# EAGLE schematic PDNode-600 Pro (EAGLE 9.2.1)

## Sheet 1 of 11
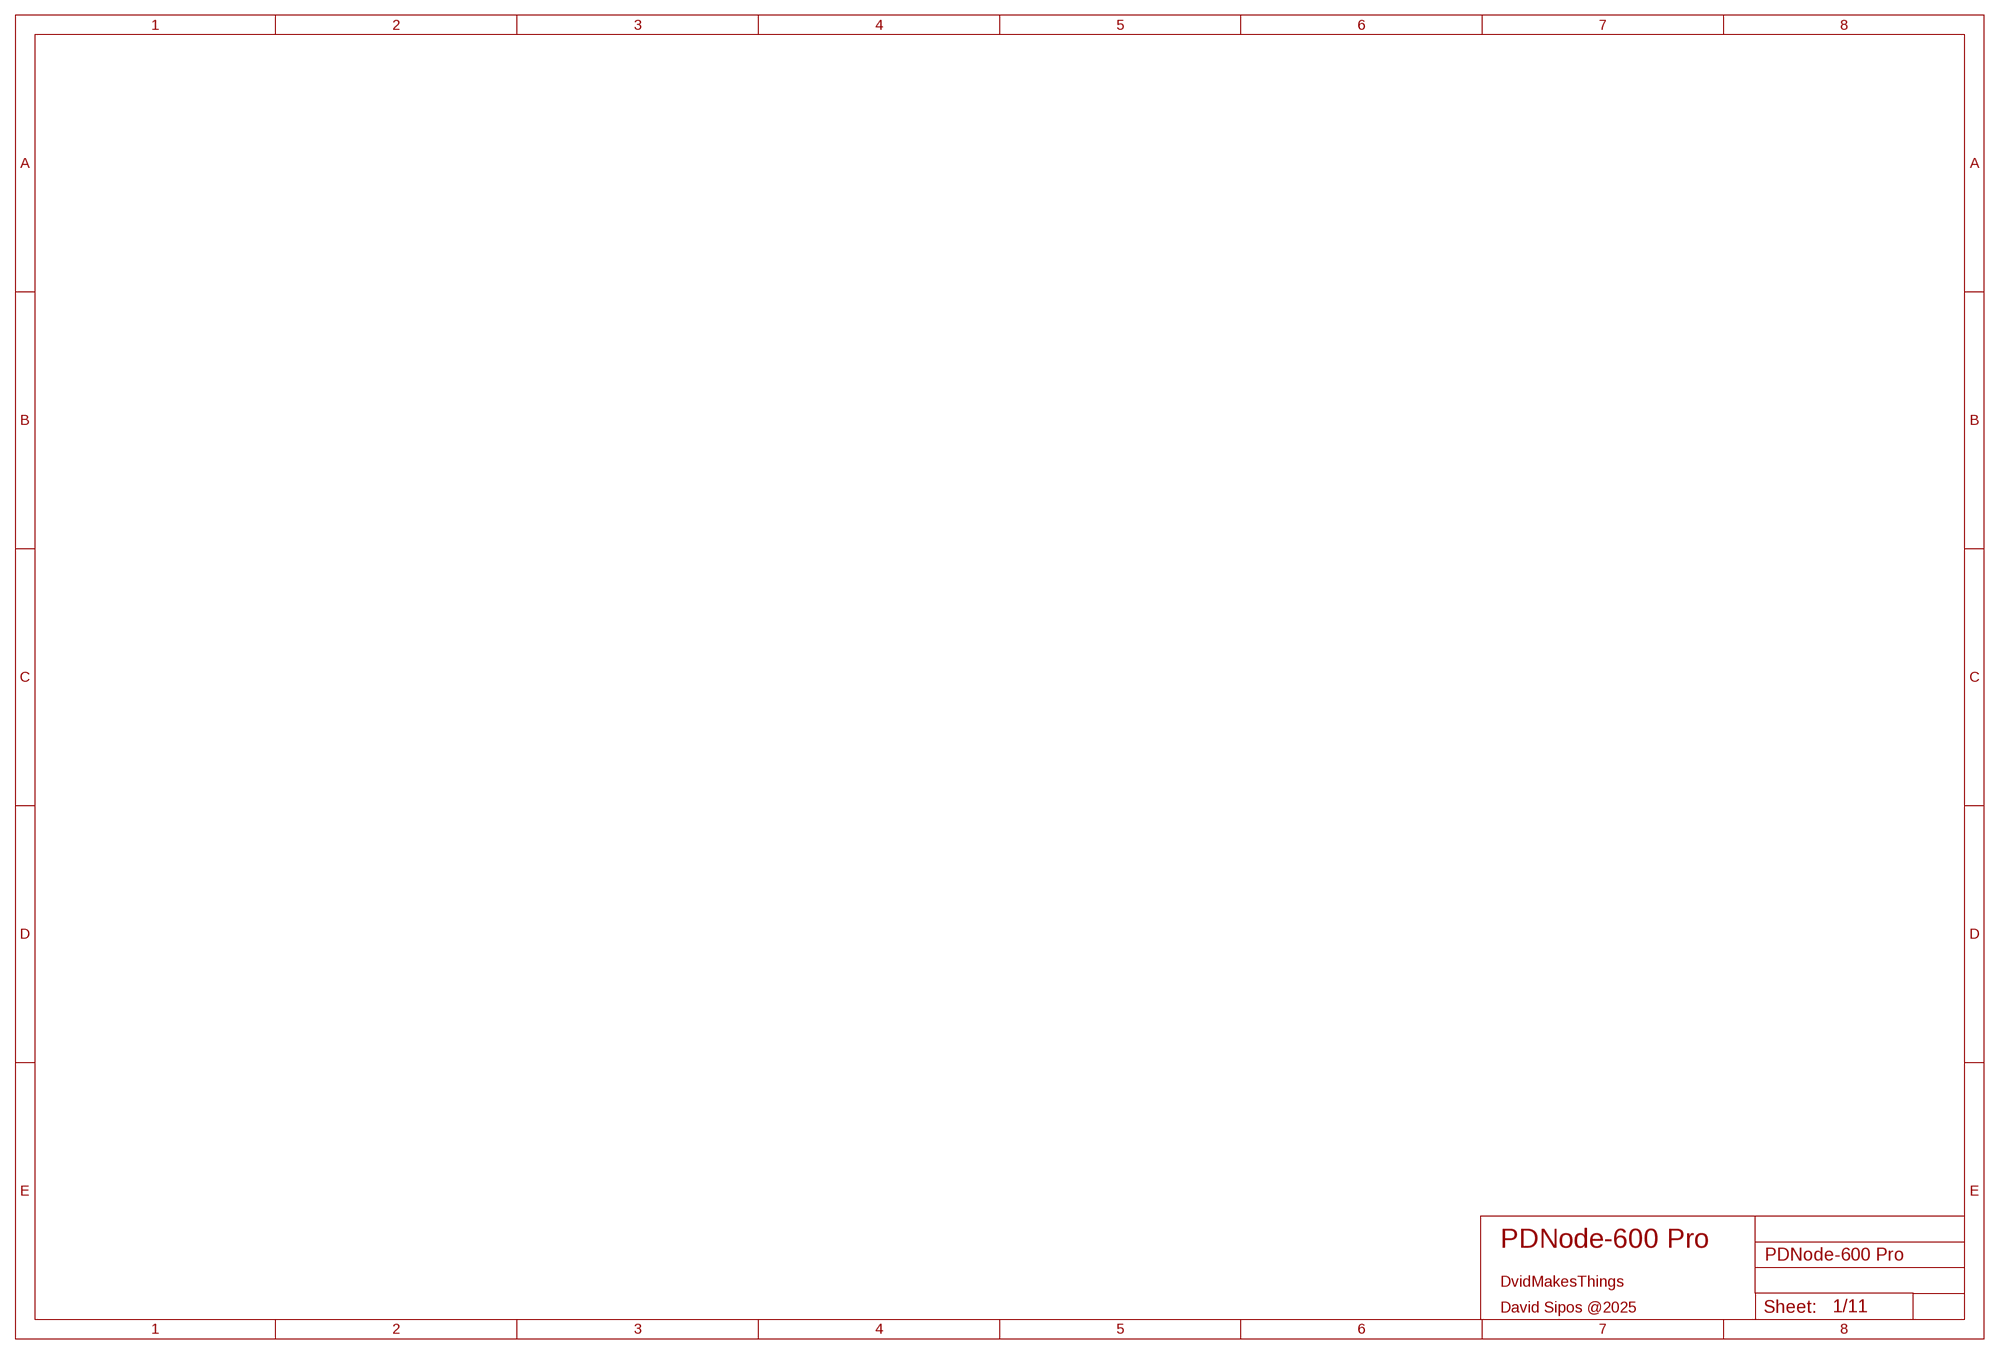
[diagram p0: schematic, sheet 1]

### Notes on the sheet
- PDNode-600 Pro
- DvidMakesThings
- David Sipos @2025

## Sheet 2 of 11
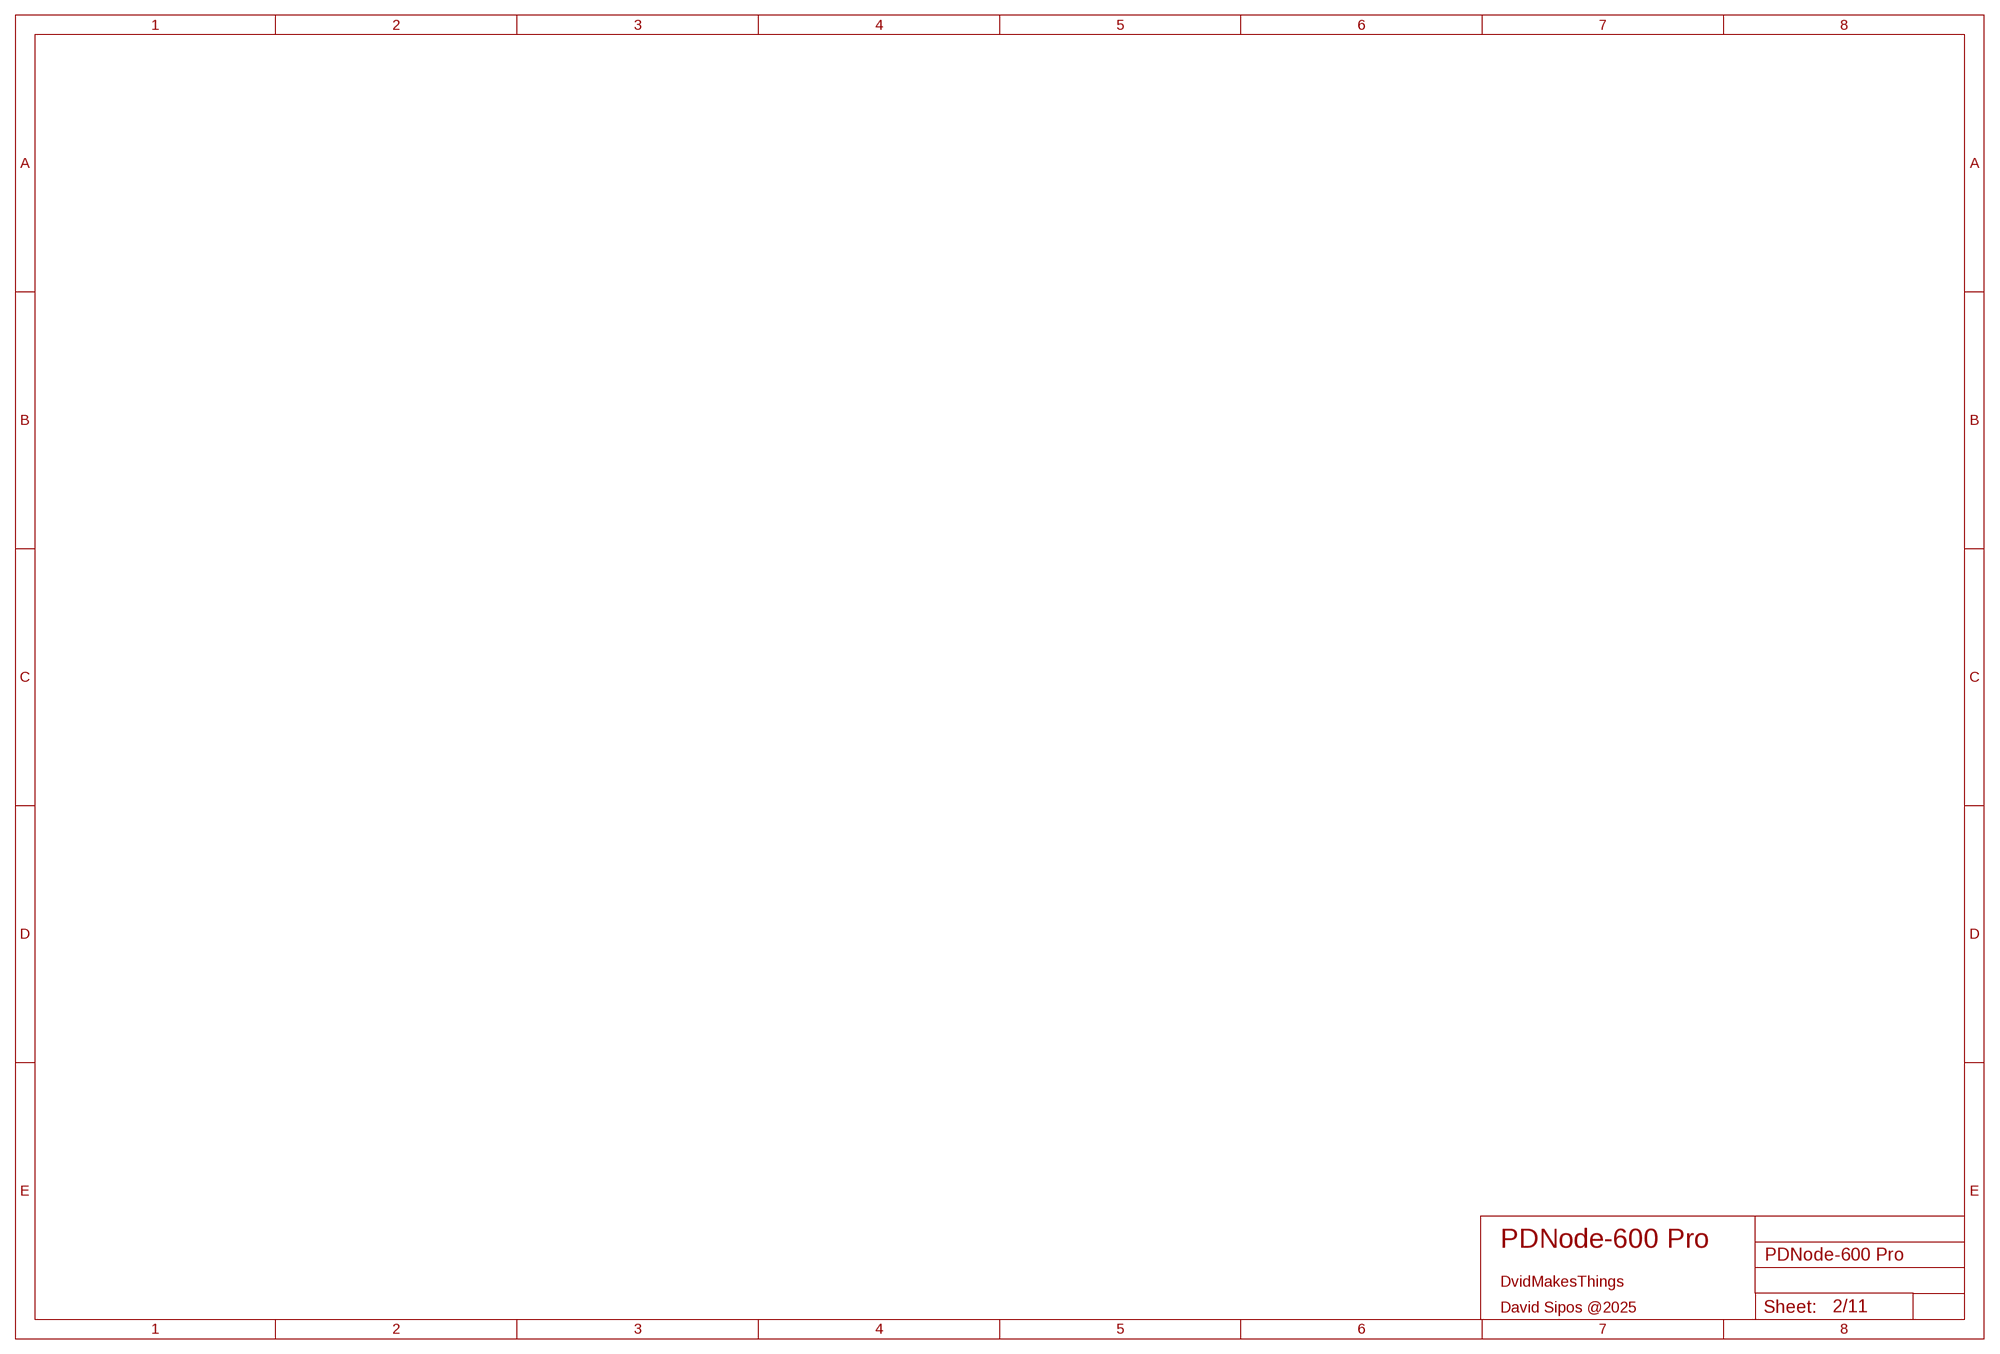
[diagram p1: schematic, sheet 2]

### Notes on the sheet
- PDNode-600 Pro
- DvidMakesThings
- David Sipos @2025

## Sheet 3 of 11: USB-A SOURCE PORT1-4
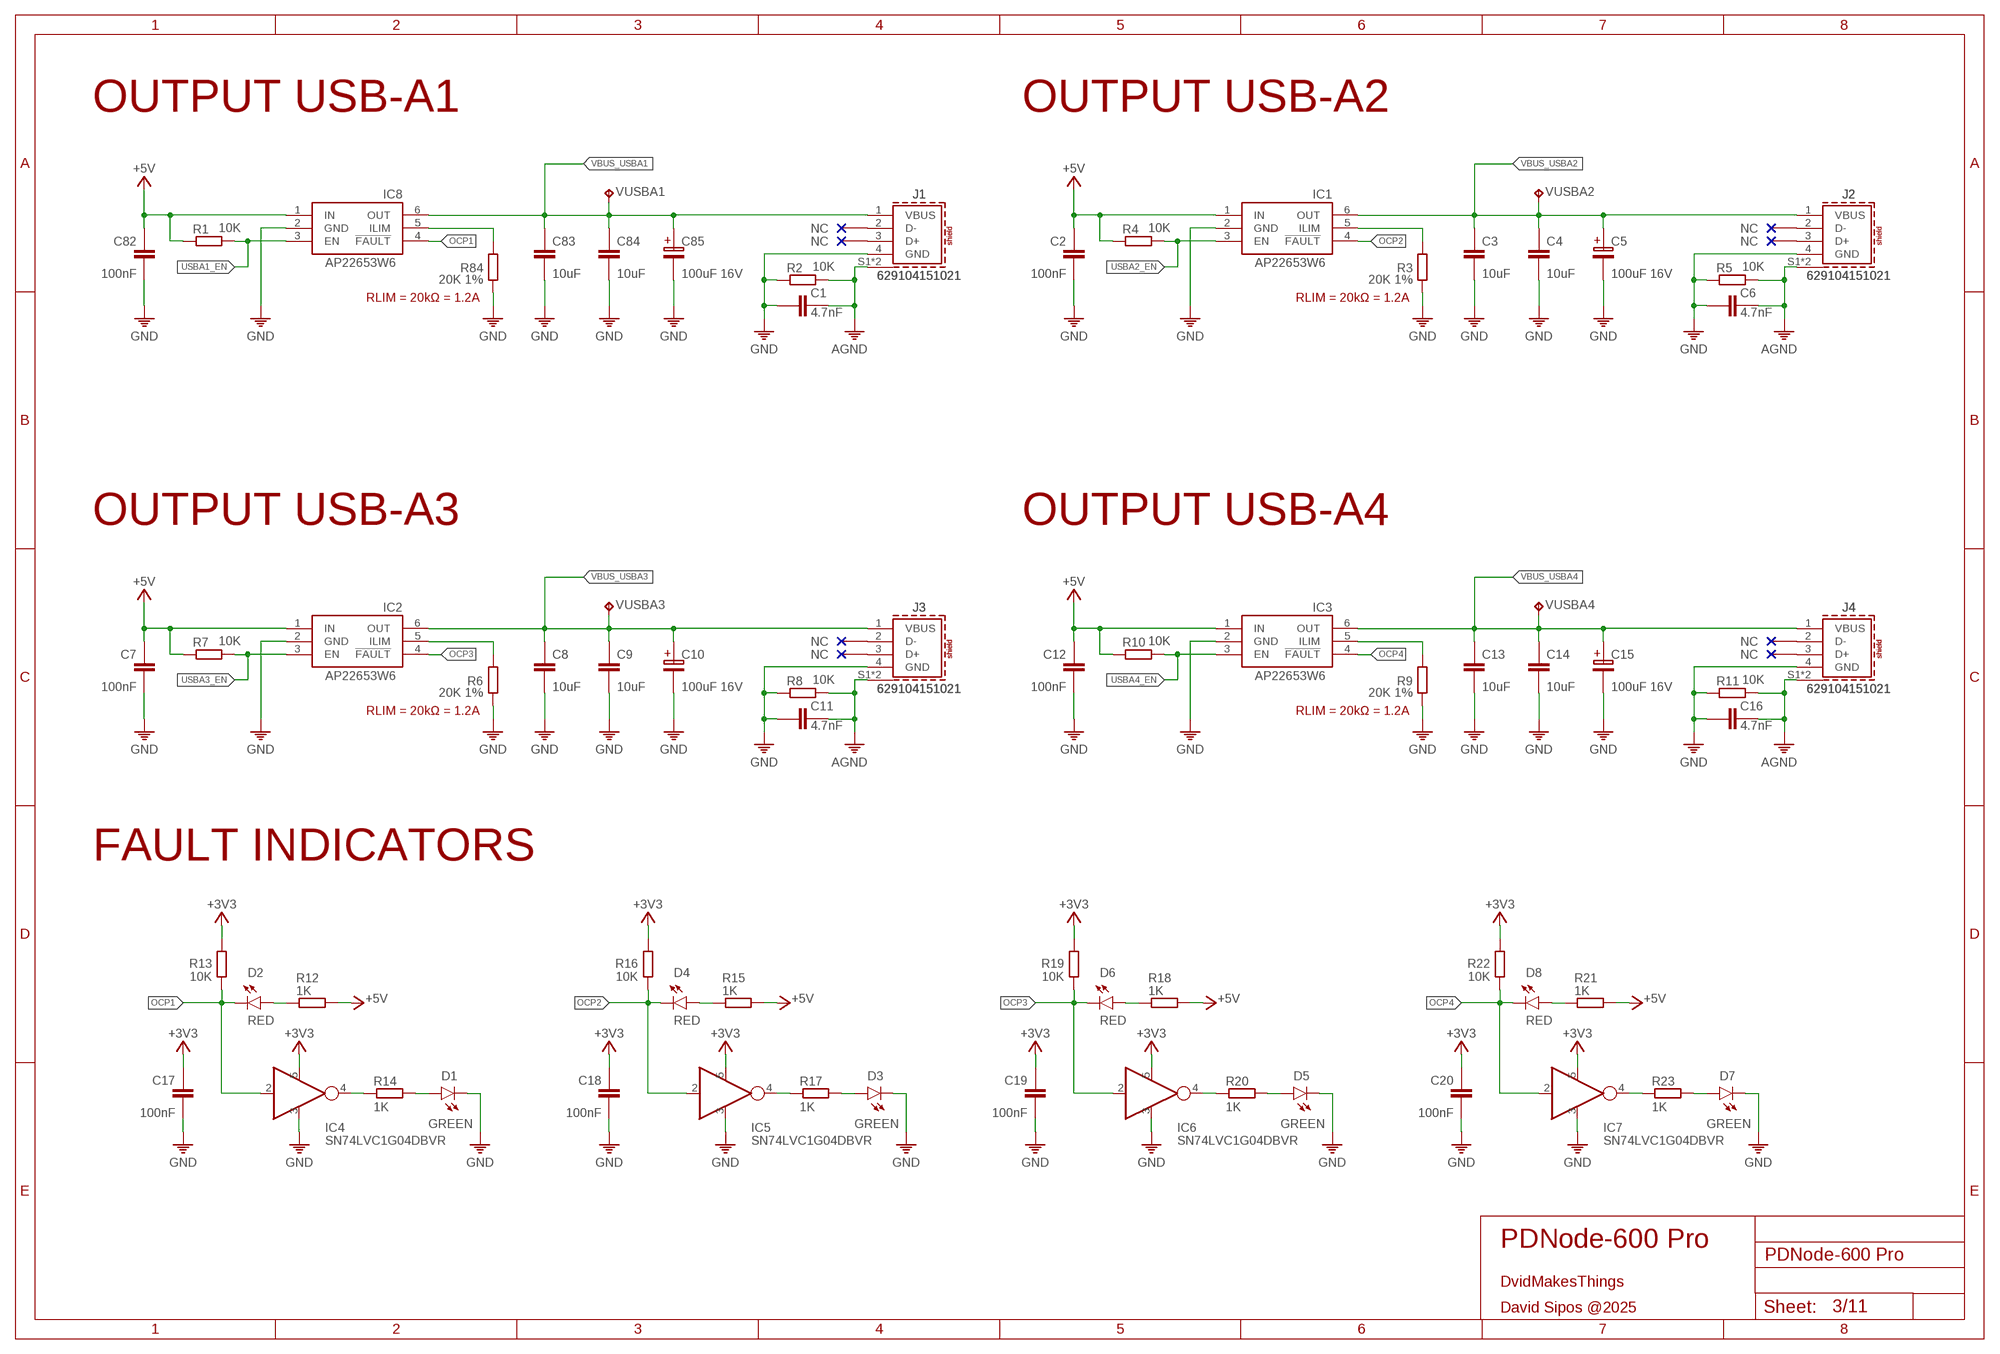
[diagram p2: schematic, sheet 3]

### Parts
C1  4.7nF  C-0402  [C0402]
C2  100nF  C-0402  [C0402]
C3  10uF  C-0805  [C0805]
C4  10uF  C-0805  [C0805]
C5  100uF 16V  CPOL  [100UF-16V]
C6  4.7nF  C-0402  [C0402]
C7  100nF  C-0402  [C0402]
C8  10uF  C-0805  [C0805]
C9  10uF  C-0805  [C0805]
C10  100uF 16V  CPOL  [100UF-16V]
C11  4.7nF  C-0402  [C0402]
C12  100nF  C-0402  [C0402]
C13  10uF  C-0805  [C0805]
C14  10uF  C-0805  [C0805]
C15  100uF 16V  CPOL  [100UF-16V]
C16  4.7nF  C-0402  [C0402]
C17  100nF  C-0402  [C0402]
C18  100nF  C-0402  [C0402]
C19  100nF  C-0402  [C0402]
C20  100nF  C-0402  [C0402]
C82  100nF  C-0402  [C0402]
C83  10uF  C-0805  [C0805]
C84  10uF  C-0805  [C0805]
C85  100uF 16V  CPOL  [100UF-16V]
D1  GREEN  CHIP-FLAT-G_0603-0.35MM  [LEDC1608X35N_FLAT-G]
D2  RED  CHIP-FLAT-R_0603-0.35MM  [LEDC1608X35N_FLAT-R]
D3  GREEN  CHIP-FLAT-G_0603-0.35MM  [LEDC1608X35N_FLAT-G]
D4  RED  CHIP-FLAT-R_0603-0.35MM  [LEDC1608X35N_FLAT-R]
D5  GREEN  CHIP-FLAT-G_0603-0.35MM  [LEDC1608X35N_FLAT-G]
D6  RED  CHIP-FLAT-R_0603-0.35MM  [LEDC1608X35N_FLAT-R]
D7  GREEN  CHIP-FLAT-G_0603-0.35MM  [LEDC1608X35N_FLAT-G]
D8  RED  CHIP-FLAT-R_0603-0.35MM  [LEDC1608X35N_FLAT-R]
IC1  AP22653W6  [SOT23-6]
IC2  AP22653W6  [SOT23-6]
IC3  AP22653W6  [SOT23-6]
IC4  SN74LVC1G04DBVR  74LVC1G04  [SOT95P280X145-5N]
IC5  SN74LVC1G04DBVR  74LVC1G04  [SOT95P280X145-5N]
IC6  SN74LVC1G04DBVR  74LVC1G04  [SOT95P280X145-5N]
IC7  SN74LVC1G04DBVR  74LVC1G04  [SOT95P280X145-5N]
IC8  AP22653W6  [SOT23-6]
J1  629104151021  [629104151021]
J2  629104151021  [629104151021]
J3  629104151021  [629104151021]
J4  629104151021  [629104151021]
R1  10K  R0402  [0402]
R2  10K  R0402  [0402]
R3  20K 1%  R0402  [0402]
R4  10K  R0402  [0402]
R5  10K  R0402  [0402]
R6  20K 1%  R0402  [0402]
R7  10K  R0402  [0402]
R8  10K  R0402  [0402]
R9  20K 1%  R0402  [0402]
R10  10K  R0402  [0402]
R11  10K  R0402  [0402]
R12  1K  R0402  [0402]
R13  10K  R0402  [0402]
R14  1K  R0402  [0402]
R15  1K  R0402  [0402]
R16  10K  R0402  [0402]
R17  1K  R0402  [0402]
R18  1K  R0402  [0402]
R19  10K  R0402  [0402]
R20  1K  R0402  [0402]
R21  1K  R0402  [0402]
R22  10K  R0402  [0402]
R23  1K  R0402  [0402]
R84  20K 1%  R0402  [0402]
VUSBA1  TPB1,27  [B1,27]
VUSBA2  TPB1,27  [B1,27]
VUSBA3  TPB1,27  [B1,27]
VUSBA4  TPB1,27  [B1,27]

### Nets
+3V3: C17.1 C18.1 C19.1 C20.1 IC4.5(V+) IC5.5(V+) IC6.5(V+) IC7.5(V+) R13.2 R16.2 R19.2 R22.2 ; also sheet 4,5,6,7,8,9,10,11
+5V: C2.1 C7.1 C12.1 C82.1 IC1.1(IN) IC2.1(IN) IC3.1(IN) IC8.1(IN) R1.1 R4.1 R7.1 R10.1 R12.2 R15.2 R18.2 R21.2
AGND: C1.2 C6.2 C11.2 C16.2 J1.S1(SHIELD) J1.S2(SHIELD) J2.S1(SHIELD) J2.S2(SHIELD) J3.S1(SHIELD) J3.S2(SHIELD) J4.S1(SHIELD) J4.S2(SHIELD) R2.2 R5.2 R8.2 R11.2 ; also sheet 4,5,6,7,8,9,10,11
GND: C1.1 C2.2 C3.2 C4.2 C5.2 C6.1 C7.2 C8.2 C9.2 C10.2 C11.1 C12.2 C13.2 C14.2 C15.2 C16.1 C17.2 C18.2 C19.2 C20.2 C82.2 C83.2 C84.2 C85.2 D1.C D3.C D5.C D7.C IC1.2(GND) IC2.2(GND) IC3.2(GND) IC4.3(V-) IC5.3(V-) IC6.3(V-) IC7.3(V-) IC8.2(GND) J1.4(GND) J2.4(GND) J3.4(GND) J4.4(GND) R2.1 R3.2 R5.1 R6.2 R8.1 R9.2 R11.1 R84.2 ; also sheet 4,5,6,7,8,9,10,11
N$1: IC1.5(ILIM) R3.1
N$2: IC2.5(ILIM) R6.1
N$3: IC3.5(ILIM) R9.1
N$4: D2.A R12.1
N$5: IC4.4(OUT) R14.1
N$6: D1.A R14.2
N$7: D4.A R15.1
N$8: IC5.4(OUT) R17.1
N$9: D3.A R17.2
N$10: D6.A R18.1
N$11: IC6.4(OUT) R20.1
N$12: D5.A R20.2
N$13: D8.A R21.1
N$14: IC7.4(OUT) R23.1
N$15: D7.A R23.2
N$46: IC8.5(ILIM) R84.1
OCP1: D2.C IC4.2(IN) IC8.4(!FAULT) R13.1
OCP2: D4.C IC1.4(!FAULT) IC5.2(IN) R16.1
OCP3: D6.C IC2.4(!FAULT) IC6.2(IN) R19.1
OCP4: D8.C IC3.4(!FAULT) IC7.2(IN) R22.1
USBA1_EN: IC8.3(EN) R1.2
USBA2_EN: IC1.3(EN) R4.2
USBA3_EN: IC2.3(EN) R7.2
USBA4_EN: IC3.3(EN) R10.2
VBUS_USBA1: C83.1 C84.1 C85.1 IC8.6(OUT) J1.1(VBUS) VUSBA1.TP
VBUS_USBA2: C3.1 C4.1 C5.1 IC1.6(OUT) J2.1(VBUS) VUSBA2.TP
VBUS_USBA3: C8.1 C9.1 C10.1 IC2.6(OUT) J3.1(VBUS) VUSBA3.TP
VBUS_USBA4: C13.1 C14.1 C15.1 IC3.6(OUT) J4.1(VBUS) VUSBA4.TP
Unconnected: J1.2(D-) J1.3(D+) J2.2(D-) J2.3(D+) J3.2(D-) J3.3(D+) J4.2(D-) J4.3(D+)

### Notes on the sheet
- OUTPUT USB-A1 | OUTPUT USB-A2
- RLIM = 20kΩ = 1.2A | RLIM = 20kΩ = 1.2A
- OUTPUT USB-A3 | OUTPUT USB-A4
- RLIM = 20kΩ = 1.2A | RLIM = 20kΩ = 1.2A
- FAULT INDICATORS
- PDNode-600 Pro
- DvidMakesThings
- David Sipos @2025

## Sheet 4 of 11: USB-C PD SOURCE PORT1
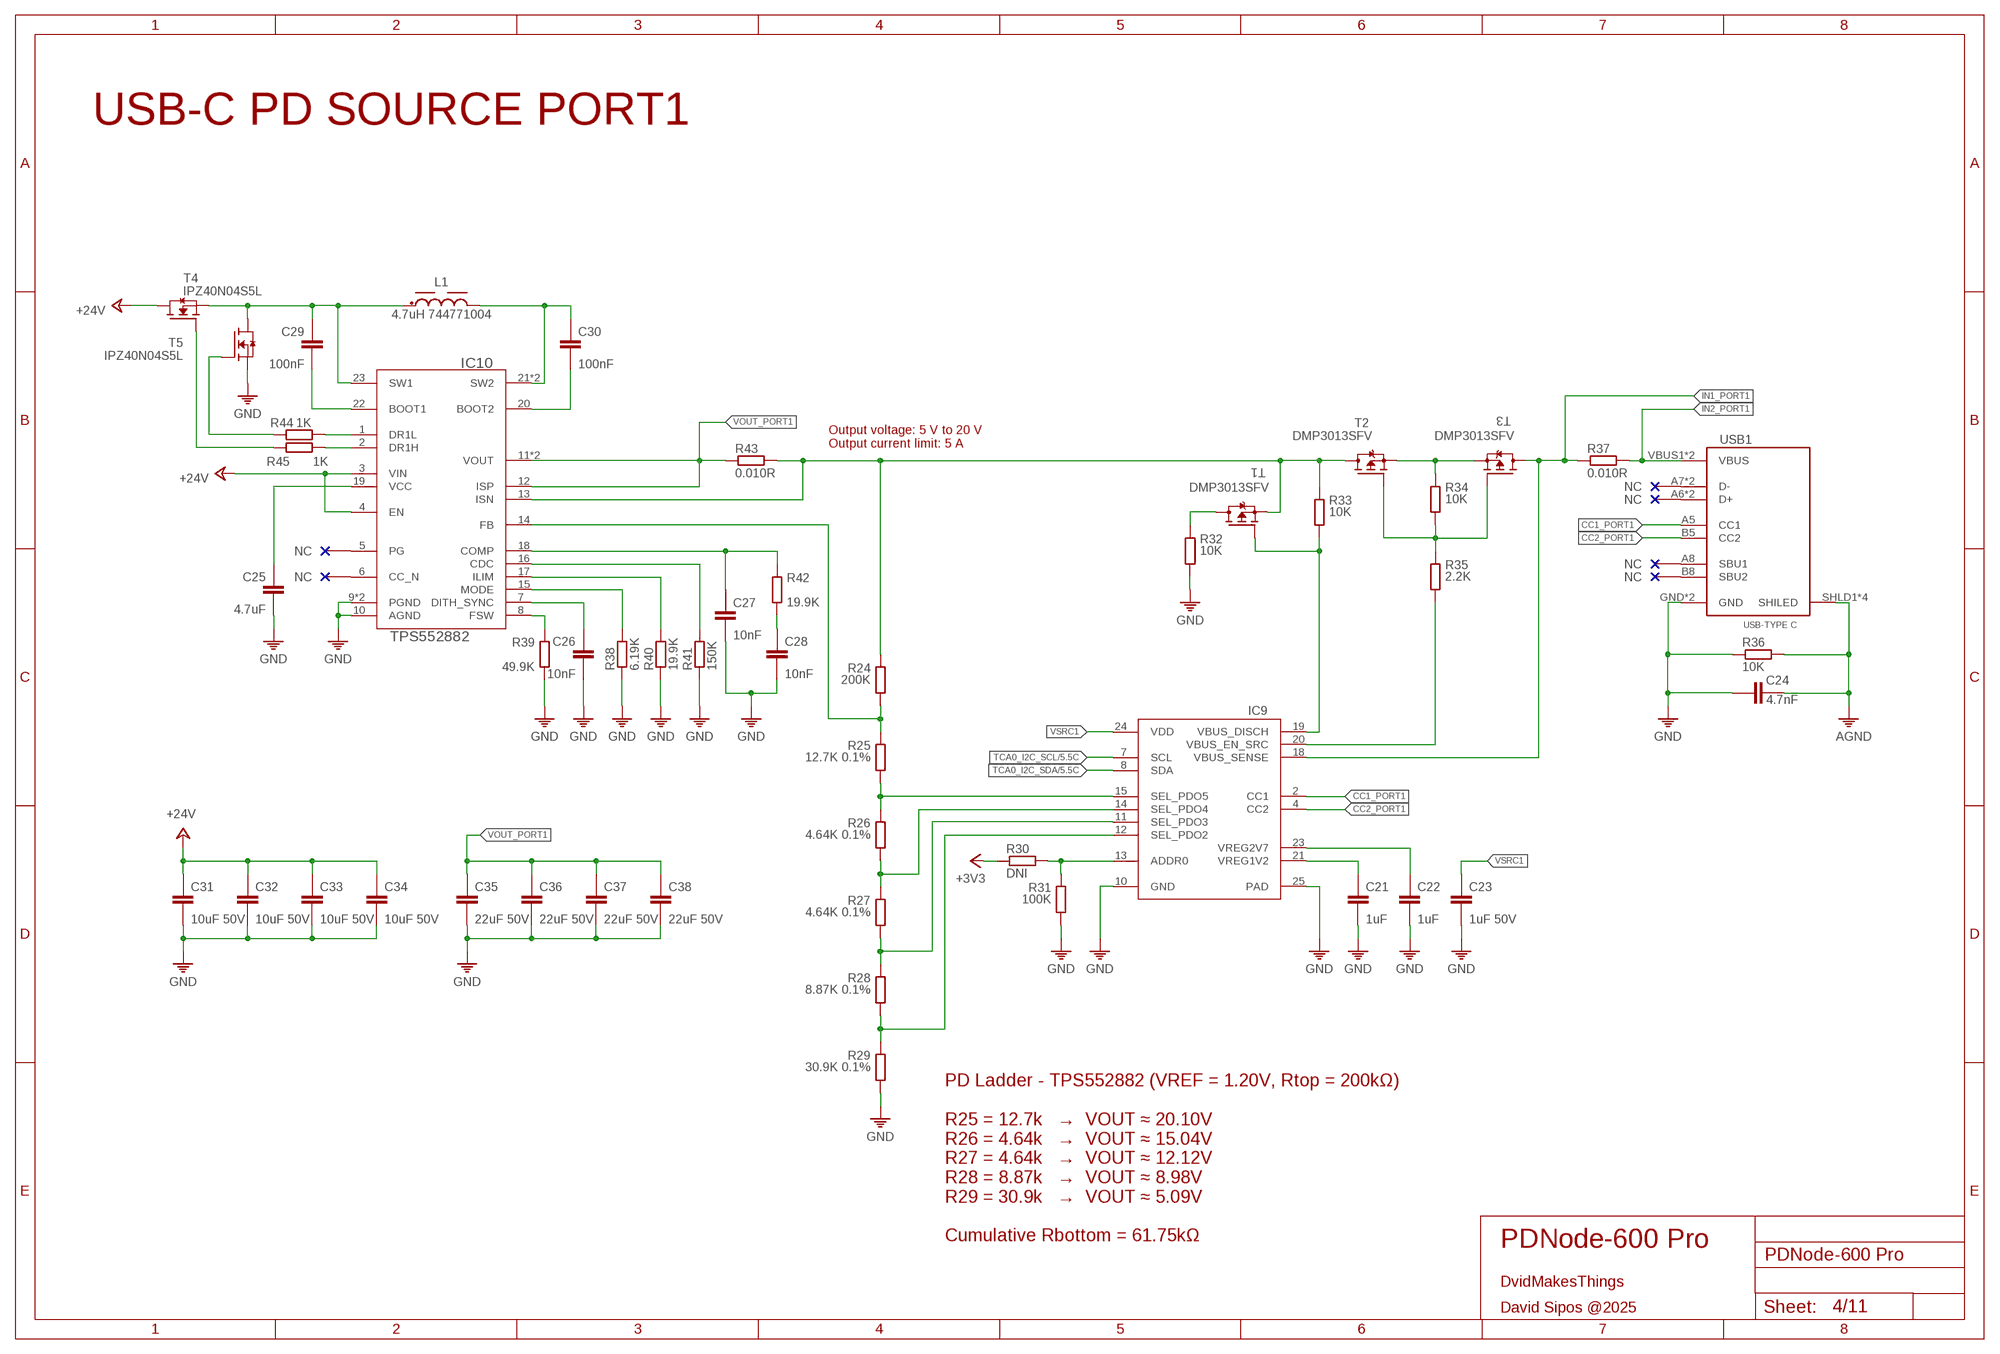
[diagram p3: schematic, sheet 4]

### Parts
C21  1uF  C-0402  [C0402]
C22  1uF  C-0402  [C0402]
C23  1uF 50V  C-0603  [C0603]
C24  4.7nF  C-0402  [C0402]
C25  4.7uF  C-0402  [C0402]
C26  10nF  C-0201  [0201]
C27  10nF  C-0201  [0201]
C28  10nF  C-0201  [0201]
C29  100nF  C-0402  [C0402]
C30  100nF  C-0402  [C0402]
C31  10uF 50V  C-0805  [C0805]
C32  10uF 50V  C-0805  [C0805]
C33  10uF 50V  C-0805  [C0805]
C34  10uF 50V  C-0805  [C0805]
C35  22uF 50V  C-0805  [C0805]
C36  22uF 50V  C-0805  [C0805]
C37  22uF 50V  C-0805  [C0805]
C38  22uF 50V  C-0805  [C0805]
IC9  STUSB4710  [QFN24]
IC10  TPS552882  [RPM0026A-MFG]
L1  4.7uH 744771004  WE-PD_1280_74477004  [WE-PD_1280]
R24  200K  R0402  [0402]
R25  12.7K 0.1%  R0402  [0402]
R26  4.64K 0.1%  R0402  [0402]
R27  4.64K 0.1%  R0402  [0402]
R28  8.87K 0.1%  R0402  [0402]
R29  30.9K 0.1%  R0402  [0402]
R30  DNI  R0201  [R0201]
R31  100K  R0201  [R0201]
R32  10K  R1206  [1206]
R33  10K  R0603  [0603]
R34  10K  R0603  [0603]
R35  2.2K  R0603  [0603]
R36  10K  R0402  [0402]
R37  0.010R  R2512  [2512]
R38  6.19K  R0201  [R0201]
R39  49.9K  R0201  [R0201]
R40  19.9K  R0201  [R0201]
R41  150K  R0201  [R0201]
R42  19.9K  R0201  [R0201]
R43  0.010R  R2512  [2512]
R44  1K  R0201  [R0201]
R45  1K  R0201  [R0201]
T1  DMP3013SFV  DMP3013SFV-7UX  [POWERDI3333-8_UX_DIO-L]
T2  DMP3013SFV  DMP3013SFV-7UX  [POWERDI3333-8_UX_DIO-L]
T3  DMP3013SFV  DMP3013SFV-7UX  [POWERDI3333-8_UX_DIO-L]
T4  IPZ40N04S5L  IPZ40N04S5L7R4ATMA1  [POWERDI3333-8_UX_DIO-L]
T5  IPZ40N04S5L  IPZ40N04S5L7R4ATMA1  [POWERDI3333-8_UX_DIO-L]
USB1  USB_C-THT  [USB-C]

### Nets
+3V3: R30.1 ; also sheet 3,5,6,7,8,9,10,11
+24V: C31.1 C32.1 C33.1 C34.1 IC10.3(VIN) IC10.4(EN) T4.5(D) T4.6(D) T4.7(D) T4.8(D) T4.9(D) ; also sheet 5,6,7,8,9,10,11
AGND: C24.2 R36.2 USB1.SHLD1(SHILED) USB1.SHLD2(SHILED) USB1.SHLD3(SHILED) USB1.SHLD4(SHILED) ; also sheet 3,5,6,7,8,9,10,11
CC1_PORT1: IC9.2(CC1) USB1.A5(CC1)
CC2_PORT1: IC9.4(CC2) USB1.B5(CC2)
GND: C21.2 C22.2 C23.2 C24.1 C25.2 C26.2 C27.2 C28.2 C31.2 C32.2 C33.2 C34.2 C35.2 C36.2 C37.2 C38.2 IC9.10(GND) IC9.25(PAD) IC10.9(PGND) IC10.10(AGND) IC10.24(PGND) R29.2 R31.2 R32.2 R36.1 R38.2 R39.2 R40.2 R41.2 T5.1(S) T5.2(S) T5.3(S) USB1.GND USB1.GND2(GND) ; also sheet 3,5,6,7,8,9,10,11
IN1_PORT1: IC9.18(VBUS_SENSE) R37.1 T3.5(D) T3.6(D) T3.7(D) T3.8(D) T3.9(D)
IN2_PORT1: R37.2 USB1.VBUS1(VBUS) USB1.VBUS2(VBUS)
N$16: IC10.14(FB) R24.2 R25.1
N$17: IC9.15(SEL_PDO5) R25.2 R26.1
N$18: IC9.14(SEL_PDO4) R26.2 R27.1
N$19: IC9.11(SEL_PDO3) R27.2 R28.1
N$20: IC9.12(SEL_PDO2) R28.2 R29.1
N$21: IC9.13(ADDR0) R30.2 R31.1
N$22: R32.1 T1.5(D) T1.6(D) T1.7(D) T1.8(D) T1.9(D)
N$23: C21.1 IC9.21(VREG1V2)
N$24: C22.1 IC9.23(VREG2V7)
N$25: IC9.19(VBUS_DISCH) R33.2 T1.4(G)
N$26: R34.1 T2.1(S) T2.2(S) T2.3(S) T3.1(S) T3.2(S) T3.3(S)
N$27: R45.2 T4.4(G)
N$28: R34.2 R35.1 T2.4(G) T3.4(G)
N$29: C28.1 R42.2
N$30: IC9.20(VBUS_EN_SRC) R35.2
N$31: IC10.8(FSW) R39.1
N$32: C26.1 IC10.7(DITH_SYNC)
N$33: IC10.15(MODE) R38.1
N$34: IC10.17(ILIM) R40.1
N$35: IC10.16(CDC) R41.1
N$36: C27.1 IC10.18(COMP) R42.1
N$37: C25.1 IC10.19(VCC)
N$38: C29.1 IC10.23(SW1) L1.1 T4.1(S) T4.2(S) T4.3(S) T5.5(D) T5.6(D) T5.7(D) T5.8(D) T5.9(D)
N$39: C30.1 IC10.21(SW2) IC10.25(SW2) L1.2
N$40: C29.2 IC10.22(BOOT1)
N$41: C30.2 IC10.20(BOOT2)
N$42: R44.2 T5.4(G)
N$43: IC10.13(ISN) R24.1 R33.1 R43.2 T1.1(S) T1.2(S) T1.3(S) T2.5(D) T2.6(D) T2.7(D) T2.8(D) T2.9(D)
N$44: IC10.1(DR1L) R44.1
N$45: IC10.2(DR1H) R45.1
TCA0_I2C_SCL: IC9.7(SCL) ; also sheet 5
TCA0_I2C_SDA: IC9.8(SDA) ; also sheet 5
VOUT_PORT1: C35.1 C36.1 C37.1 C38.1 IC10.11(VOUT) IC10.12(ISP) IC10.26(VOUT) R43.1
VSRC1: C23.1 IC9.24(VDD)
Unconnected: IC10.5(PG) IC10.6(CC_N) USB1.A6(D+) USB1.A7(D-) USB1.A8(SBU1) USB1.B6(D+) USB1.B7(D-) USB1.B8(SBU2)

### Notes on the sheet
- USB-C PD SOURCE PORT1
- Output voltage: 5 V to 20 V
  Output current limit: 5 A
- PDNode-600 Pro
- PD Ladder - TPS552882 (VREF = 1.20V, Rtop = 200kΩ)
  
  R25 = 12.7k   →  VOUT ≈ 20.10V
  R26 = 4.64k   →  VOUT ≈ 15.04V
  R27 = 4.64k   →  VOUT ≈ 12.12V
  R28 = 8.87k   →  VOUT ≈ 8.98V
  R29 = 30.9k   →  VOUT ≈ 5.09V
  
  Cumulative Rbottom = 61.75kΩ
- DvidMakesThings
- David Sipos @2025

## Sheet 5 of 11: USB-C PD SOURCE PORT2
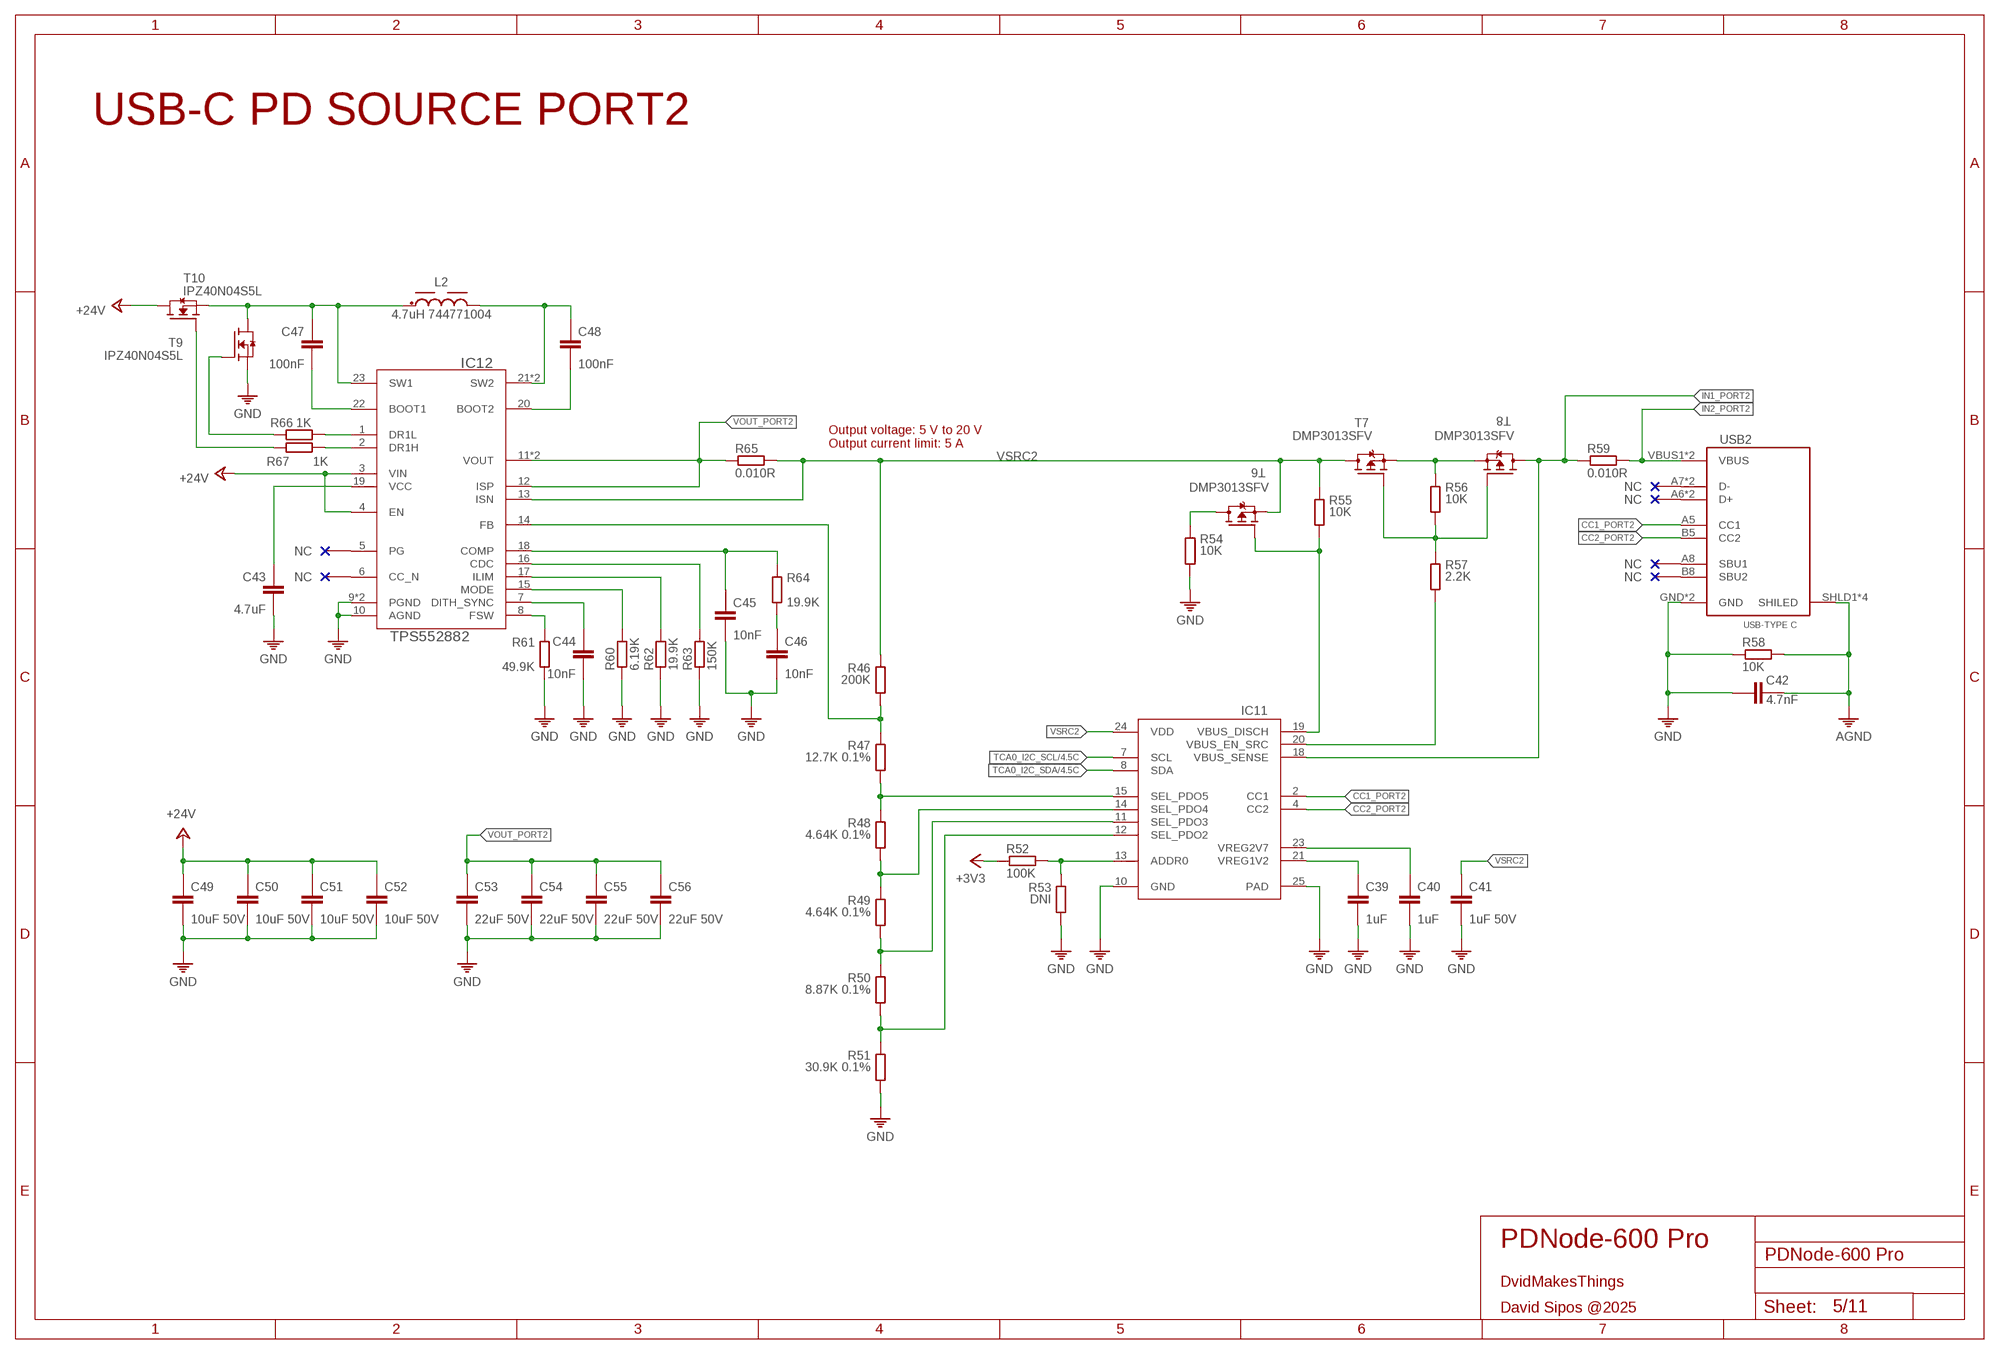
[diagram p4: schematic, sheet 5]

### Parts
C39  1uF  C-0402  [C0402]
C40  1uF  C-0402  [C0402]
C41  1uF 50V  C-0603  [C0603]
C42  4.7nF  C-0402  [C0402]
C43  4.7uF  C-0402  [C0402]
C44  10nF  C-0201  [0201]
C45  10nF  C-0201  [0201]
C46  10nF  C-0201  [0201]
C47  100nF  C-0402  [C0402]
C48  100nF  C-0402  [C0402]
C49  10uF 50V  C-0805  [C0805]
C50  10uF 50V  C-0805  [C0805]
C51  10uF 50V  C-0805  [C0805]
C52  10uF 50V  C-0805  [C0805]
C53  22uF 50V  C-0805  [C0805]
C54  22uF 50V  C-0805  [C0805]
C55  22uF 50V  C-0805  [C0805]
C56  22uF 50V  C-0805  [C0805]
IC11  STUSB4710  [QFN24]
IC12  TPS552882  [RPM0026A-MFG]
L2  4.7uH 744771004  WE-PD_1280_74477004  [WE-PD_1280]
R46  200K  R0402  [0402]
R47  12.7K 0.1%  R0402  [0402]
R48  4.64K 0.1%  R0402  [0402]
R49  4.64K 0.1%  R0402  [0402]
R50  8.87K 0.1%  R0402  [0402]
R51  30.9K 0.1%  R0402  [0402]
R52  100K  R0201  [R0201]
R53  DNI  R0201  [R0201]
R54  10K  R1206  [1206]
R55  10K  R0603  [0603]
R56  10K  R0603  [0603]
R57  2.2K  R0603  [0603]
R58  10K  R0402  [0402]
R59  0.010R  R2512  [2512]
R60  6.19K  R0201  [R0201]
R61  49.9K  R0201  [R0201]
R62  19.9K  R0201  [R0201]
R63  150K  R0201  [R0201]
R64  19.9K  R0201  [R0201]
R65  0.010R  R2512  [2512]
R66  1K  R0201  [R0201]
R67  1K  R0201  [R0201]
T6  DMP3013SFV  DMP3013SFV-7UX  [POWERDI3333-8_UX_DIO-L]
T7  DMP3013SFV  DMP3013SFV-7UX  [POWERDI3333-8_UX_DIO-L]
T8  DMP3013SFV  DMP3013SFV-7UX  [POWERDI3333-8_UX_DIO-L]
T9  IPZ40N04S5L  IPZ40N04S5L7R4ATMA1  [POWERDI3333-8_UX_DIO-L]
T10  IPZ40N04S5L  IPZ40N04S5L7R4ATMA1  [POWERDI3333-8_UX_DIO-L]
USB2  USB_C-THT  [USB-C]

### Nets
+3V3: R52.1 ; also sheet 3,4,6,7,8,9,10,11
+24V: C49.1 C50.1 C51.1 C52.1 IC12.3(VIN) IC12.4(EN) T10.5(D) T10.6(D) T10.7(D) T10.8(D) T10.9(D) ; also sheet 4,6,7,8,9,10,11
AGND: C42.2 R58.2 USB2.SHLD1(SHILED) USB2.SHLD2(SHILED) USB2.SHLD3(SHILED) USB2.SHLD4(SHILED) ; also sheet 3,4,6,7,8,9,10,11
CC1_PORT2: IC11.2(CC1) USB2.A5(CC1)
CC2_PORT2: IC11.4(CC2) USB2.B5(CC2)
GND: C39.2 C40.2 C41.2 C42.1 C43.2 C44.2 C45.2 C46.2 C49.2 C50.2 C51.2 C52.2 C53.2 C54.2 C55.2 C56.2 IC11.10(GND) IC11.25(PAD) IC12.9(PGND) IC12.10(AGND) IC12.24(PGND) R51.2 R53.2 R54.2 R58.1 R60.2 R61.2 R62.2 R63.2 T9.1(S) T9.2(S) T9.3(S) USB2.GND USB2.GND2(GND) ; also sheet 3,4,6,7,8,9,10,11
IN1_PORT2: IC11.18(VBUS_SENSE) R59.1 T8.5(D) T8.6(D) T8.7(D) T8.8(D) T8.9(D)
IN2_PORT2: R59.2 USB2.VBUS1(VBUS) USB2.VBUS2(VBUS)
N$47: IC12.14(FB) R46.2 R47.1
N$48: IC11.15(SEL_PDO5) R47.2 R48.1
N$49: IC11.14(SEL_PDO4) R48.2 R49.1
N$50: IC11.11(SEL_PDO3) R49.2 R50.1
N$51: IC11.12(SEL_PDO2) R50.2 R51.1
N$52: C39.1 IC11.21(VREG1V2)
N$53: C40.1 IC11.23(VREG2V7)
N$54: IC11.13(ADDR0) R52.2 R53.1
N$55: R54.1 T6.5(D) T6.6(D) T6.7(D) T6.8(D) T6.9(D)
N$56: IC11.19(VBUS_DISCH) R55.2 T6.4(G)
N$57: R56.1 T7.1(S) T7.2(S) T7.3(S) T8.1(S) T8.2(S) T8.3(S)
N$58: R56.2 R57.1 T7.4(G) T8.4(G)
N$59: IC11.20(VBUS_EN_SRC) R57.2
N$60: C46.1 R64.2
N$61: IC12.8(FSW) R61.1
N$62: C44.1 IC12.7(DITH_SYNC)
N$63: IC12.15(MODE) R60.1
N$64: IC12.17(ILIM) R62.1
N$65: IC12.16(CDC) R63.1
N$66: C45.1 IC12.18(COMP) R64.1
N$67: C43.1 IC12.19(VCC)
N$68: C47.1 IC12.23(SW1) L2.1 T9.5(D) T9.6(D) T9.7(D) T9.8(D) T9.9(D) T10.1(S) T10.2(S) T10.3(S)
N$69: C48.1 IC12.21(SW2) IC12.25(SW2) L2.2
N$70: C47.2 IC12.22(BOOT1)
N$71: C48.2 IC12.20(BOOT2)
N$73: R67.2 T10.4(G)
N$74: R66.2 T9.4(G)
N$75: IC12.1(DR1L) R66.1
N$76: IC12.2(DR1H) R67.1
TCA0_I2C_SCL: IC11.7(SCL) ; also sheet 4
TCA0_I2C_SDA: IC11.8(SDA) ; also sheet 4
VOUT_PORT2: C53.1 C54.1 C55.1 C56.1 IC12.11(VOUT) IC12.12(ISP) IC12.26(VOUT) R65.1
VSRC2: C41.1 IC11.24(VDD) IC12.13(ISN) R46.1 R55.1 R65.2 T6.1(S) T6.2(S) T6.3(S) T7.5(D) T7.6(D) T7.7(D) T7.8(D) T7.9(D)
Unconnected: IC12.5(PG) IC12.6(CC_N) USB2.A6(D+) USB2.A7(D-) USB2.A8(SBU1) USB2.B6(D+) USB2.B7(D-) USB2.B8(SBU2)

### Notes on the sheet
- USB-C PD SOURCE PORT2
- Output voltage: 5 V to 20 V
  Output current limit: 5 A
- PDNode-600 Pro
- DvidMakesThings
- David Sipos @2025

## Sheet 6 of 11: USB-C PD SOURCE PORT3
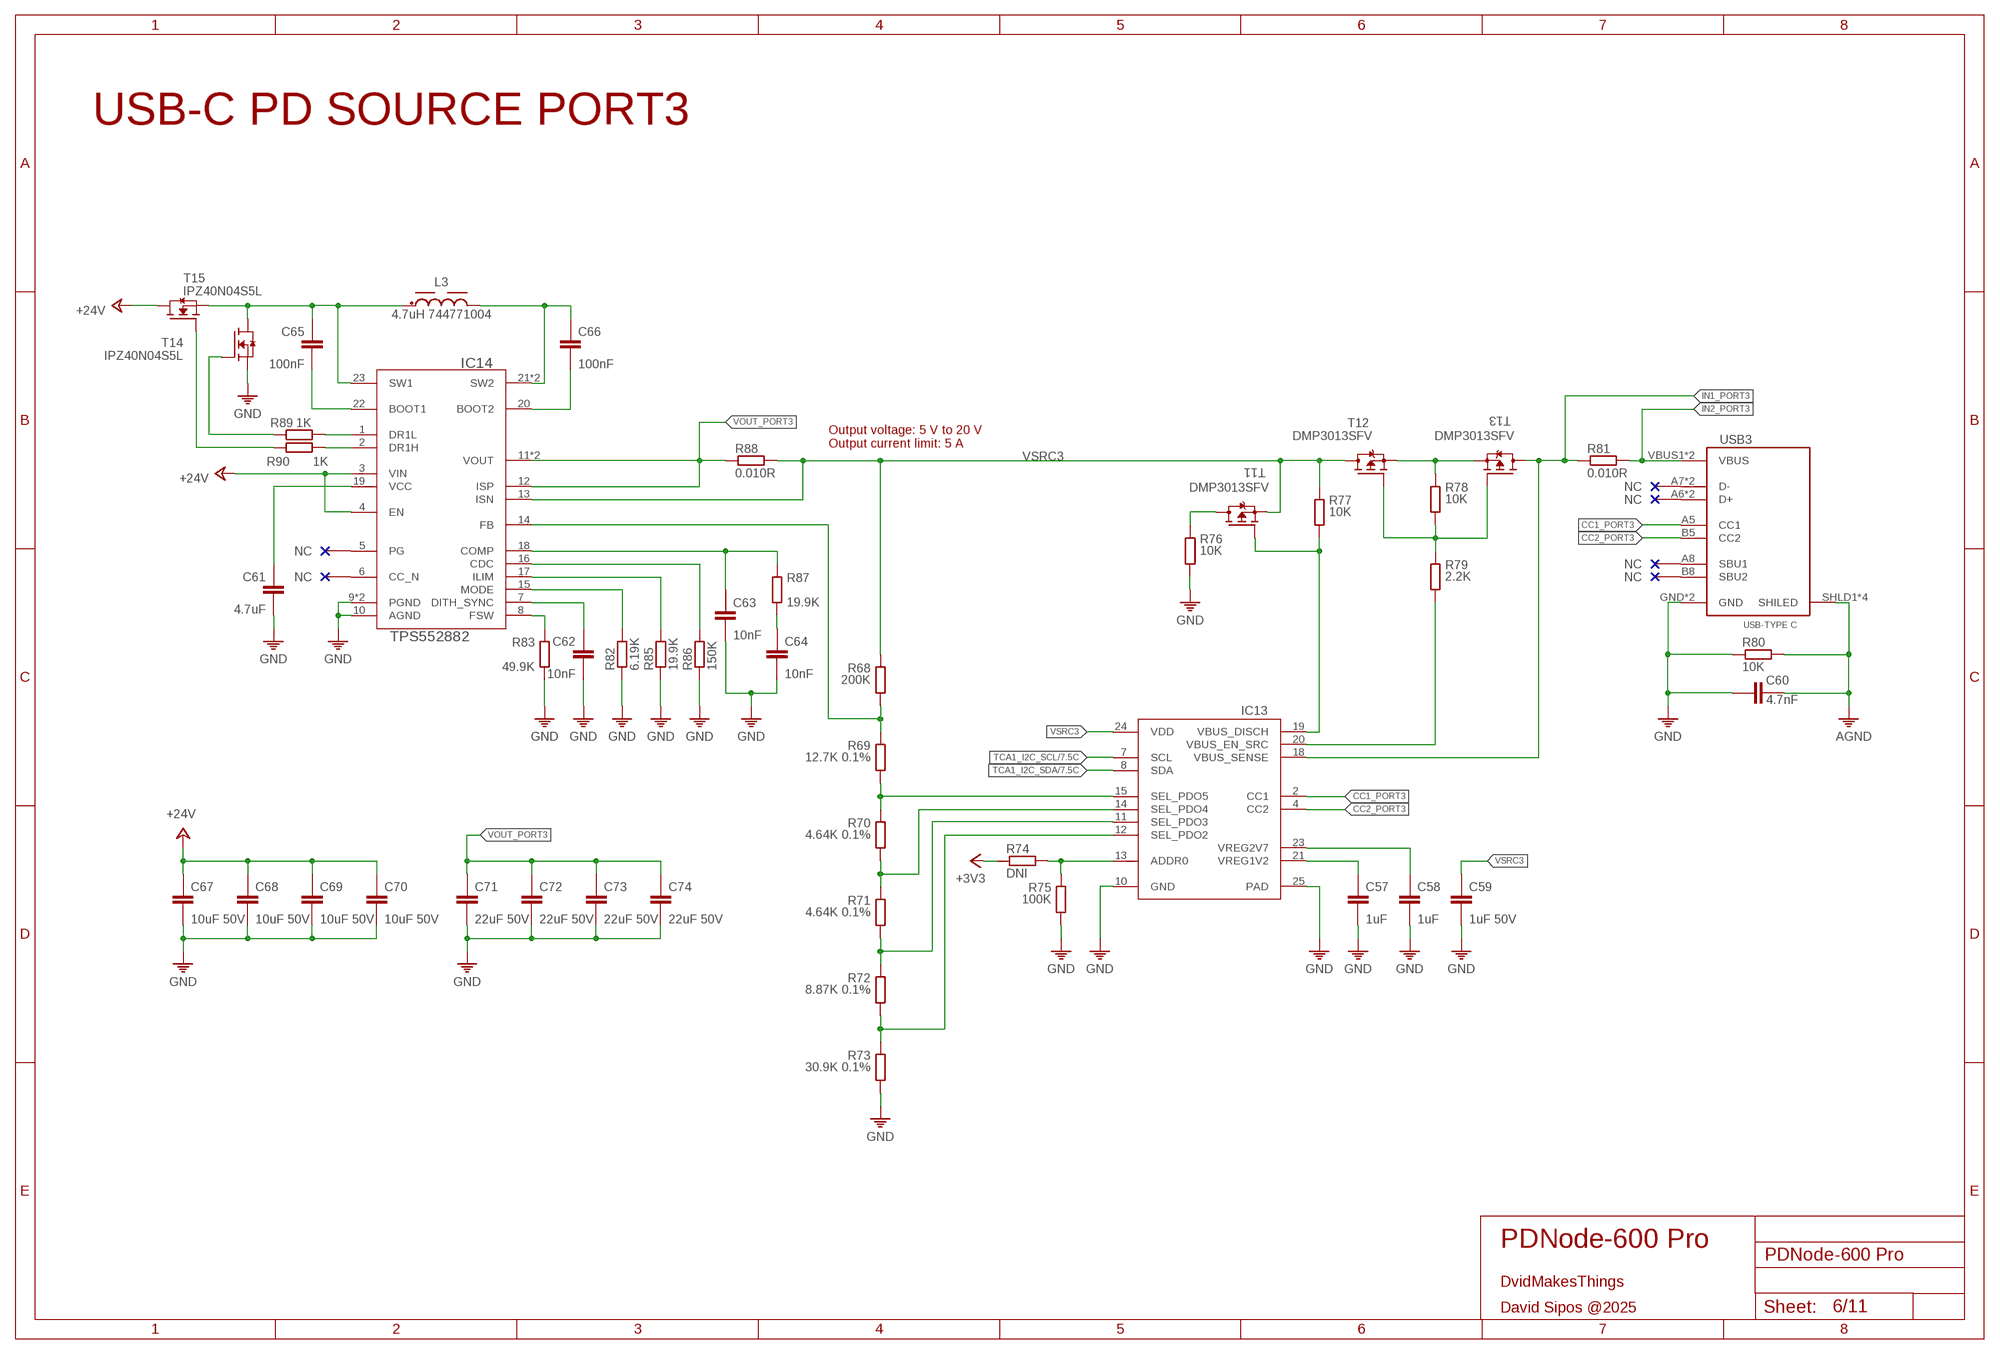
[diagram p5: schematic, sheet 6]

### Parts
C57  1uF  C-0402  [C0402]
C58  1uF  C-0402  [C0402]
C59  1uF 50V  C-0603  [C0603]
C60  4.7nF  C-0402  [C0402]
C61  4.7uF  C-0402  [C0402]
C62  10nF  C-0201  [0201]
C63  10nF  C-0201  [0201]
C64  10nF  C-0201  [0201]
C65  100nF  C-0402  [C0402]
C66  100nF  C-0402  [C0402]
C67  10uF 50V  C-0805  [C0805]
C68  10uF 50V  C-0805  [C0805]
C69  10uF 50V  C-0805  [C0805]
C70  10uF 50V  C-0805  [C0805]
C71  22uF 50V  C-0805  [C0805]
C72  22uF 50V  C-0805  [C0805]
C73  22uF 50V  C-0805  [C0805]
C74  22uF 50V  C-0805  [C0805]
IC13  STUSB4710  [QFN24]
IC14  TPS552882  [RPM0026A-MFG]
L3  4.7uH 744771004  WE-PD_1280_74477004  [WE-PD_1280]
R68  200K  R0402  [0402]
R69  12.7K 0.1%  R0402  [0402]
R70  4.64K 0.1%  R0402  [0402]
R71  4.64K 0.1%  R0402  [0402]
R72  8.87K 0.1%  R0402  [0402]
R73  30.9K 0.1%  R0402  [0402]
R74  DNI  R0201  [R0201]
R75  100K  R0201  [R0201]
R76  10K  R1206  [1206]
R77  10K  R0603  [0603]
R78  10K  R0603  [0603]
R79  2.2K  R0603  [0603]
R80  10K  R0402  [0402]
R81  0.010R  R2512  [2512]
R82  6.19K  R0201  [R0201]
R83  49.9K  R0201  [R0201]
R85  19.9K  R0201  [R0201]
R86  150K  R0201  [R0201]
R87  19.9K  R0201  [R0201]
R88  0.010R  R2512  [2512]
R89  1K  R0201  [R0201]
R90  1K  R0201  [R0201]
T11  DMP3013SFV  DMP3013SFV-7UX  [POWERDI3333-8_UX_DIO-L]
T12  DMP3013SFV  DMP3013SFV-7UX  [POWERDI3333-8_UX_DIO-L]
T13  DMP3013SFV  DMP3013SFV-7UX  [POWERDI3333-8_UX_DIO-L]
T14  IPZ40N04S5L  IPZ40N04S5L7R4ATMA1  [POWERDI3333-8_UX_DIO-L]
T15  IPZ40N04S5L  IPZ40N04S5L7R4ATMA1  [POWERDI3333-8_UX_DIO-L]
USB3  USB_C-THT  [USB-C]

### Nets
+3V3: R74.1 ; also sheet 3,4,5,7,8,9,10,11
+24V: C67.1 C68.1 C69.1 C70.1 IC14.3(VIN) IC14.4(EN) T15.5(D) T15.6(D) T15.7(D) T15.8(D) T15.9(D) ; also sheet 4,5,7,8,9,10,11
AGND: C60.2 R80.2 USB3.SHLD1(SHILED) USB3.SHLD2(SHILED) USB3.SHLD3(SHILED) USB3.SHLD4(SHILED) ; also sheet 3,4,5,7,8,9,10,11
CC1_PORT3: IC13.2(CC1) USB3.A5(CC1)
CC2_PORT3: IC13.4(CC2) USB3.B5(CC2)
GND: C57.2 C58.2 C59.2 C60.1 C61.2 C62.2 C63.2 C64.2 C67.2 C68.2 C69.2 C70.2 C71.2 C72.2 C73.2 C74.2 IC13.10(GND) IC13.25(PAD) IC14.9(PGND) IC14.10(AGND) IC14.24(PGND) R73.2 R75.2 R76.2 R80.1 R82.2 R83.2 R85.2 R86.2 T14.1(S) T14.2(S) T14.3(S) USB3.GND USB3.GND2(GND) ; also sheet 3,4,5,7,8,9,10,11
IN1_PORT3: IC13.18(VBUS_SENSE) R81.1 T13.5(D) T13.6(D) T13.7(D) T13.8(D) T13.9(D)
IN2_PORT3: R81.2 USB3.VBUS1(VBUS) USB3.VBUS2(VBUS)
N$77: IC14.14(FB) R68.2 R69.1
N$78: IC13.15(SEL_PDO5) R69.2 R70.1
N$79: IC13.14(SEL_PDO4) R70.2 R71.1
N$80: IC13.11(SEL_PDO3) R71.2 R72.1
N$81: IC13.12(SEL_PDO2) R72.2 R73.1
N$82: C57.1 IC13.21(VREG1V2)
N$83: C58.1 IC13.23(VREG2V7)
N$84: IC13.13(ADDR0) R74.2 R75.1
N$85: R76.1 T11.5(D) T11.6(D) T11.7(D) T11.8(D) T11.9(D)
N$86: IC13.19(VBUS_DISCH) R77.2 T11.4(G)
N$87: R78.1 T12.1(S) T12.2(S) T12.3(S) T13.1(S) T13.2(S) T13.3(S)
N$88: R78.2 R79.1 T12.4(G) T13.4(G)
N$89: IC13.20(VBUS_EN_SRC) R79.2
N$90: C64.1 R87.2
N$91: IC14.8(FSW) R83.1
N$92: C62.1 IC14.7(DITH_SYNC)
N$93: IC14.15(MODE) R82.1
N$94: IC14.17(ILIM) R85.1
N$95: IC14.16(CDC) R86.1
N$96: C63.1 IC14.18(COMP) R87.1
N$97: C61.1 IC14.19(VCC)
N$98: C65.1 IC14.23(SW1) L3.1 T14.5(D) T14.6(D) T14.7(D) T14.8(D) T14.9(D) T15.1(S) T15.2(S) T15.3(S)
N$99: C66.1 IC14.21(SW2) IC14.25(SW2) L3.2
N$100: C65.2 IC14.22(BOOT1)
N$101: C66.2 IC14.20(BOOT2)
N$103: R90.2 T15.4(G)
N$104: R89.2 T14.4(G)
N$105: IC14.1(DR1L) R89.1
N$106: IC14.2(DR1H) R90.1
TCA1_I2C_SCL: IC13.7(SCL) ; also sheet 7
TCA1_I2C_SDA: IC13.8(SDA) ; also sheet 7
VOUT_PORT3: C71.1 C72.1 C73.1 C74.1 IC14.11(VOUT) IC14.12(ISP) IC14.26(VOUT) R88.1
VSRC3: C59.1 IC13.24(VDD) IC14.13(ISN) R68.1 R77.1 R88.2 T11.1(S) T11.2(S) T11.3(S) T12.5(D) T12.6(D) T12.7(D) T12.8(D) T12.9(D)
Unconnected: IC14.5(PG) IC14.6(CC_N) USB3.A6(D+) USB3.A7(D-) USB3.A8(SBU1) USB3.B6(D+) USB3.B7(D-) USB3.B8(SBU2)

### Notes on the sheet
- USB-C PD SOURCE PORT3
- Output voltage: 5 V to 20 V
  Output current limit: 5 A
- PDNode-600 Pro
- DvidMakesThings
- David Sipos @2025

## Sheet 7 of 11: USB-C PD SOURCE PORT4
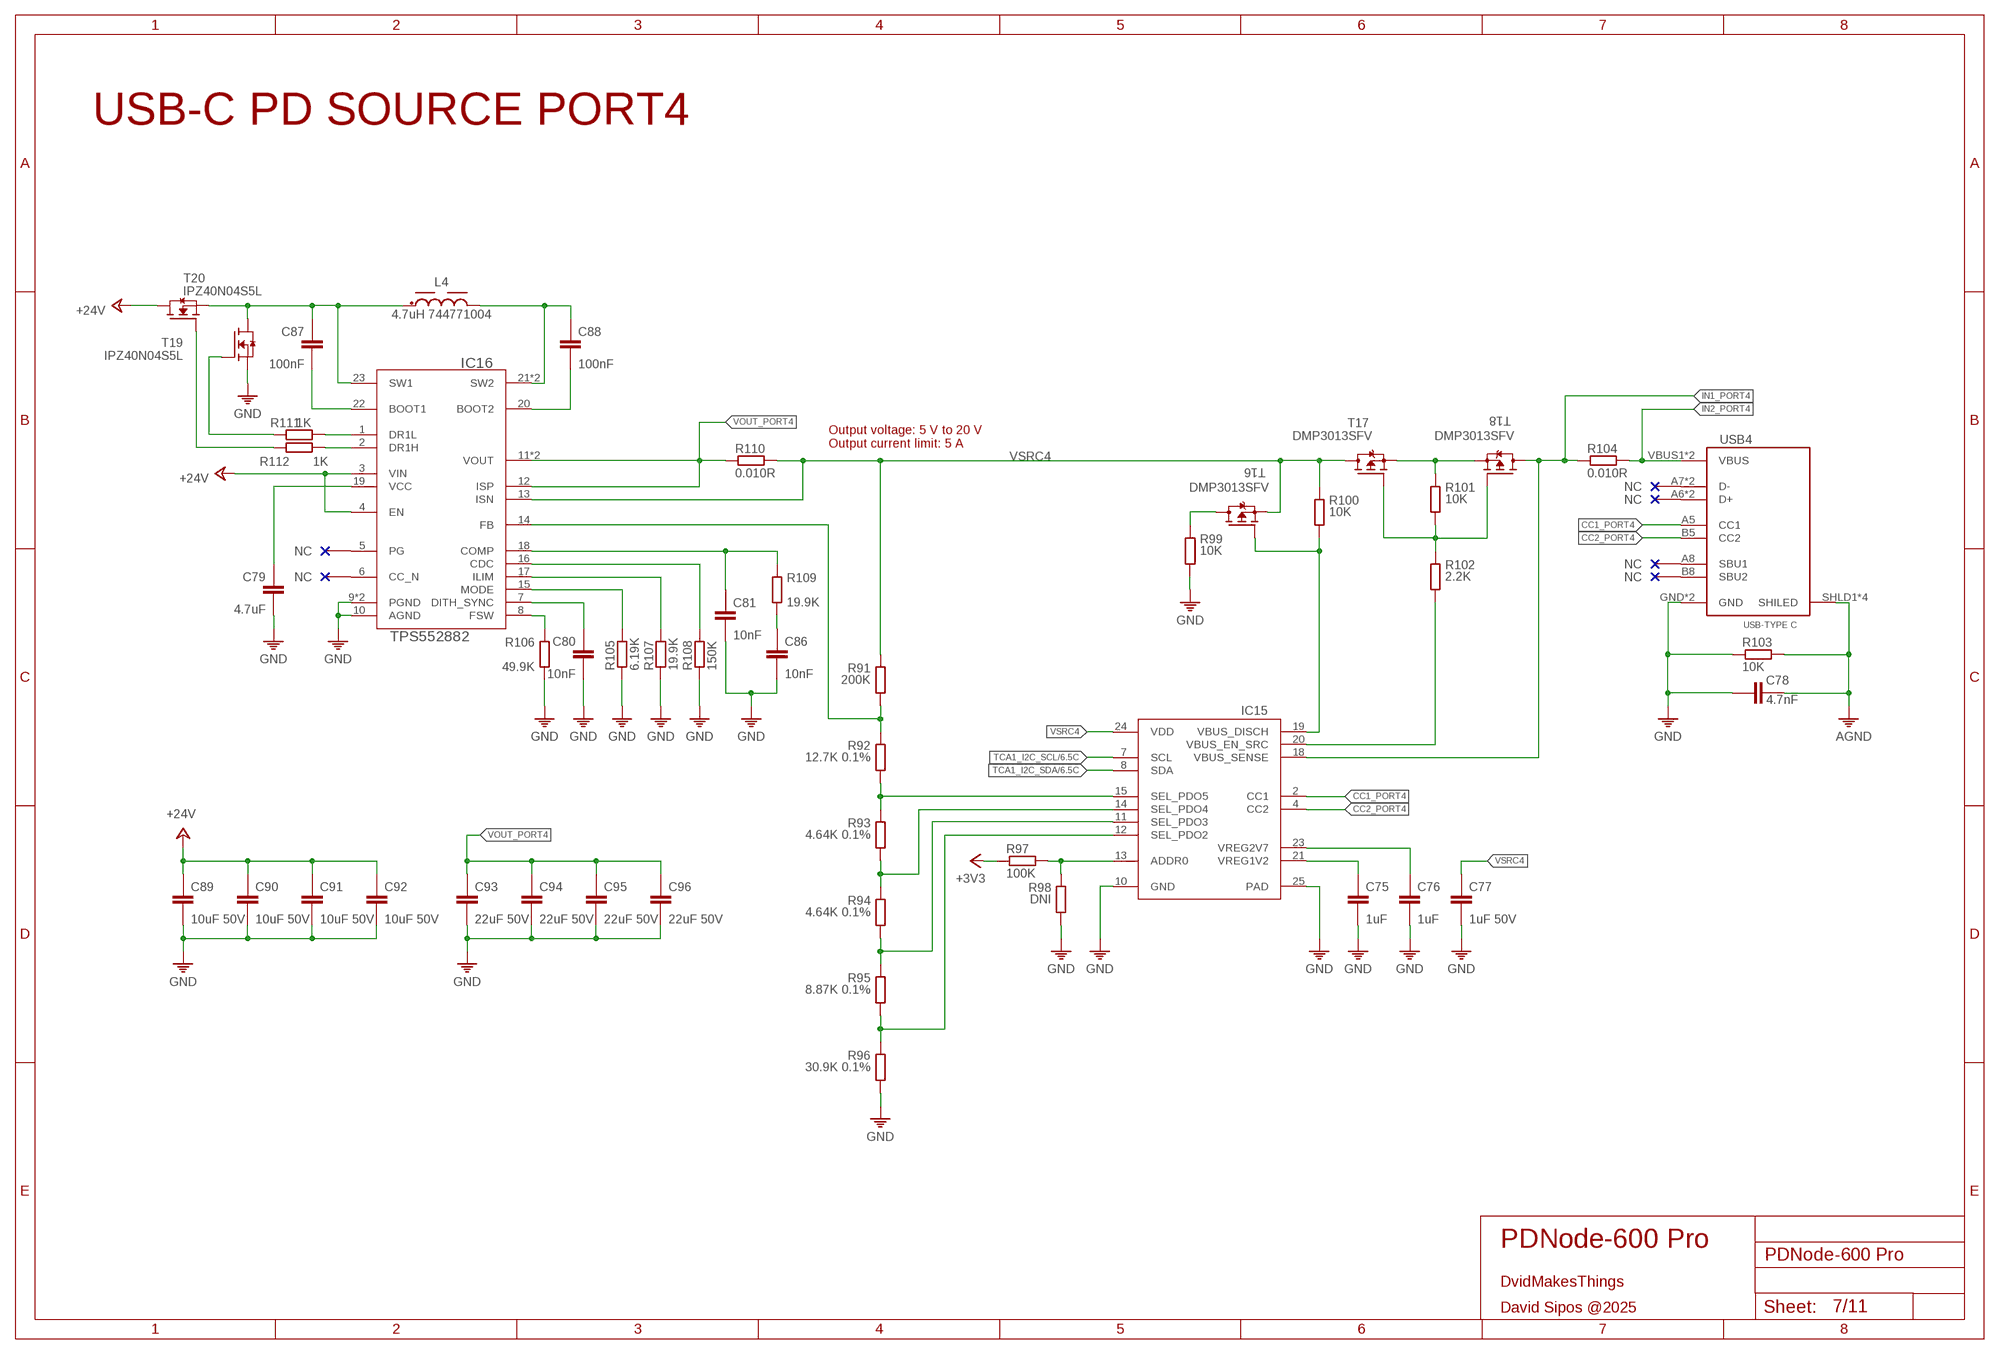
[diagram p6: schematic, sheet 7]

### Parts
C75  1uF  C-0402  [C0402]
C76  1uF  C-0402  [C0402]
C77  1uF 50V  C-0603  [C0603]
C78  4.7nF  C-0402  [C0402]
C79  4.7uF  C-0402  [C0402]
C80  10nF  C-0201  [0201]
C81  10nF  C-0201  [0201]
C86  10nF  C-0201  [0201]
C87  100nF  C-0402  [C0402]
C88  100nF  C-0402  [C0402]
C89  10uF 50V  C-0805  [C0805]
C90  10uF 50V  C-0805  [C0805]
C91  10uF 50V  C-0805  [C0805]
C92  10uF 50V  C-0805  [C0805]
C93  22uF 50V  C-0805  [C0805]
C94  22uF 50V  C-0805  [C0805]
C95  22uF 50V  C-0805  [C0805]
C96  22uF 50V  C-0805  [C0805]
IC15  STUSB4710  [QFN24]
IC16  TPS552882  [RPM0026A-MFG]
L4  4.7uH 744771004  WE-PD_1280_74477004  [WE-PD_1280]
R91  200K  R0402  [0402]
R92  12.7K 0.1%  R0402  [0402]
R93  4.64K 0.1%  R0402  [0402]
R94  4.64K 0.1%  R0402  [0402]
R95  8.87K 0.1%  R0402  [0402]
R96  30.9K 0.1%  R0402  [0402]
R97  100K  R0201  [R0201]
R98  DNI  R0201  [R0201]
R99  10K  R1206  [1206]
R100  10K  R0603  [0603]
R101  10K  R0603  [0603]
R102  2.2K  R0603  [0603]
R103  10K  R0402  [0402]
R104  0.010R  R2512  [2512]
R105  6.19K  R0201  [R0201]
R106  49.9K  R0201  [R0201]
R107  19.9K  R0201  [R0201]
R108  150K  R0201  [R0201]
R109  19.9K  R0201  [R0201]
R110  0.010R  R2512  [2512]
R111  1K  R0201  [R0201]
R112  1K  R0201  [R0201]
T16  DMP3013SFV  DMP3013SFV-7UX  [POWERDI3333-8_UX_DIO-L]
T17  DMP3013SFV  DMP3013SFV-7UX  [POWERDI3333-8_UX_DIO-L]
T18  DMP3013SFV  DMP3013SFV-7UX  [POWERDI3333-8_UX_DIO-L]
T19  IPZ40N04S5L  IPZ40N04S5L7R4ATMA1  [POWERDI3333-8_UX_DIO-L]
T20  IPZ40N04S5L  IPZ40N04S5L7R4ATMA1  [POWERDI3333-8_UX_DIO-L]
USB4  USB_C-THT  [USB-C]

### Nets
+3V3: R97.1 ; also sheet 3,4,5,6,8,9,10,11
+24V: C89.1 C90.1 C91.1 C92.1 IC16.3(VIN) IC16.4(EN) T20.5(D) T20.6(D) T20.7(D) T20.8(D) T20.9(D) ; also sheet 4,5,6,8,9,10,11
AGND: C78.2 R103.2 USB4.SHLD1(SHILED) USB4.SHLD2(SHILED) USB4.SHLD3(SHILED) USB4.SHLD4(SHILED) ; also sheet 3,4,5,6,8,9,10,11
CC1_PORT4: IC15.2(CC1) USB4.A5(CC1)
CC2_PORT4: IC15.4(CC2) USB4.B5(CC2)
GND: C75.2 C76.2 C77.2 C78.1 C79.2 C80.2 C81.2 C86.2 C89.2 C90.2 C91.2 C92.2 C93.2 C94.2 C95.2 C96.2 IC15.10(GND) IC15.25(PAD) IC16.9(PGND) IC16.10(AGND) IC16.24(PGND) R96.2 R98.2 R99.2 R103.1 R105.2 R106.2 R107.2 R108.2 T19.1(S) T19.2(S) T19.3(S) USB4.GND USB4.GND2(GND) ; also sheet 3,4,5,6,8,9,10,11
IN1_PORT4: IC15.18(VBUS_SENSE) R104.1 T18.5(D) T18.6(D) T18.7(D) T18.8(D) T18.9(D)
IN2_PORT4: R104.2 USB4.VBUS1(VBUS) USB4.VBUS2(VBUS)
N$107: IC16.14(FB) R91.2 R92.1
N$108: IC15.15(SEL_PDO5) R92.2 R93.1
N$109: IC15.14(SEL_PDO4) R93.2 R94.1
N$110: IC15.11(SEL_PDO3) R94.2 R95.1
N$111: IC15.12(SEL_PDO2) R95.2 R96.1
N$112: C75.1 IC15.21(VREG1V2)
N$113: C76.1 IC15.23(VREG2V7)
N$114: IC15.13(ADDR0) R97.2 R98.1
N$115: R99.1 T16.5(D) T16.6(D) T16.7(D) T16.8(D) T16.9(D)
N$116: IC15.19(VBUS_DISCH) R100.2 T16.4(G)
N$117: R101.1 T17.1(S) T17.2(S) T17.3(S) T18.1(S) T18.2(S) T18.3(S)
N$118: R101.2 R102.1 T17.4(G) T18.4(G)
N$119: IC15.20(VBUS_EN_SRC) R102.2
N$120: C86.1 R109.2
N$121: IC16.8(FSW) R106.1
N$122: C80.1 IC16.7(DITH_SYNC)
N$123: IC16.15(MODE) R105.1
N$124: IC16.17(ILIM) R107.1
N$125: IC16.16(CDC) R108.1
N$126: C81.1 IC16.18(COMP) R109.1
N$127: C79.1 IC16.19(VCC)
N$128: C87.1 IC16.23(SW1) L4.1 T19.5(D) T19.6(D) T19.7(D) T19.8(D) T19.9(D) T20.1(S) T20.2(S) T20.3(S)
N$129: C88.1 IC16.21(SW2) IC16.25(SW2) L4.2
N$130: C87.2 IC16.22(BOOT1)
N$131: C88.2 IC16.20(BOOT2)
N$133: R112.2 T20.4(G)
N$134: R111.2 T19.4(G)
N$135: IC16.1(DR1L) R111.1
N$136: IC16.2(DR1H) R112.1
TCA1_I2C_SCL: IC15.7(SCL) ; also sheet 6
TCA1_I2C_SDA: IC15.8(SDA) ; also sheet 6
VOUT_PORT4: C93.1 C94.1 C95.1 C96.1 IC16.11(VOUT) IC16.12(ISP) IC16.26(VOUT) R110.1
VSRC4: C77.1 IC15.24(VDD) IC16.13(ISN) R91.1 R100.1 R110.2 T16.1(S) T16.2(S) T16.3(S) T17.5(D) T17.6(D) T17.7(D) T17.8(D) T17.9(D)
Unconnected: IC16.5(PG) IC16.6(CC_N) USB4.A6(D+) USB4.A7(D-) USB4.A8(SBU1) USB4.B6(D+) USB4.B7(D-) USB4.B8(SBU2)

### Notes on the sheet
- USB-C PD SOURCE PORT4
- Output voltage: 5 V to 20 V
  Output current limit: 5 A
- PDNode-600 Pro
- DvidMakesThings
- David Sipos @2025

## Sheet 8 of 11: USB-C PD SOURCE PORT5
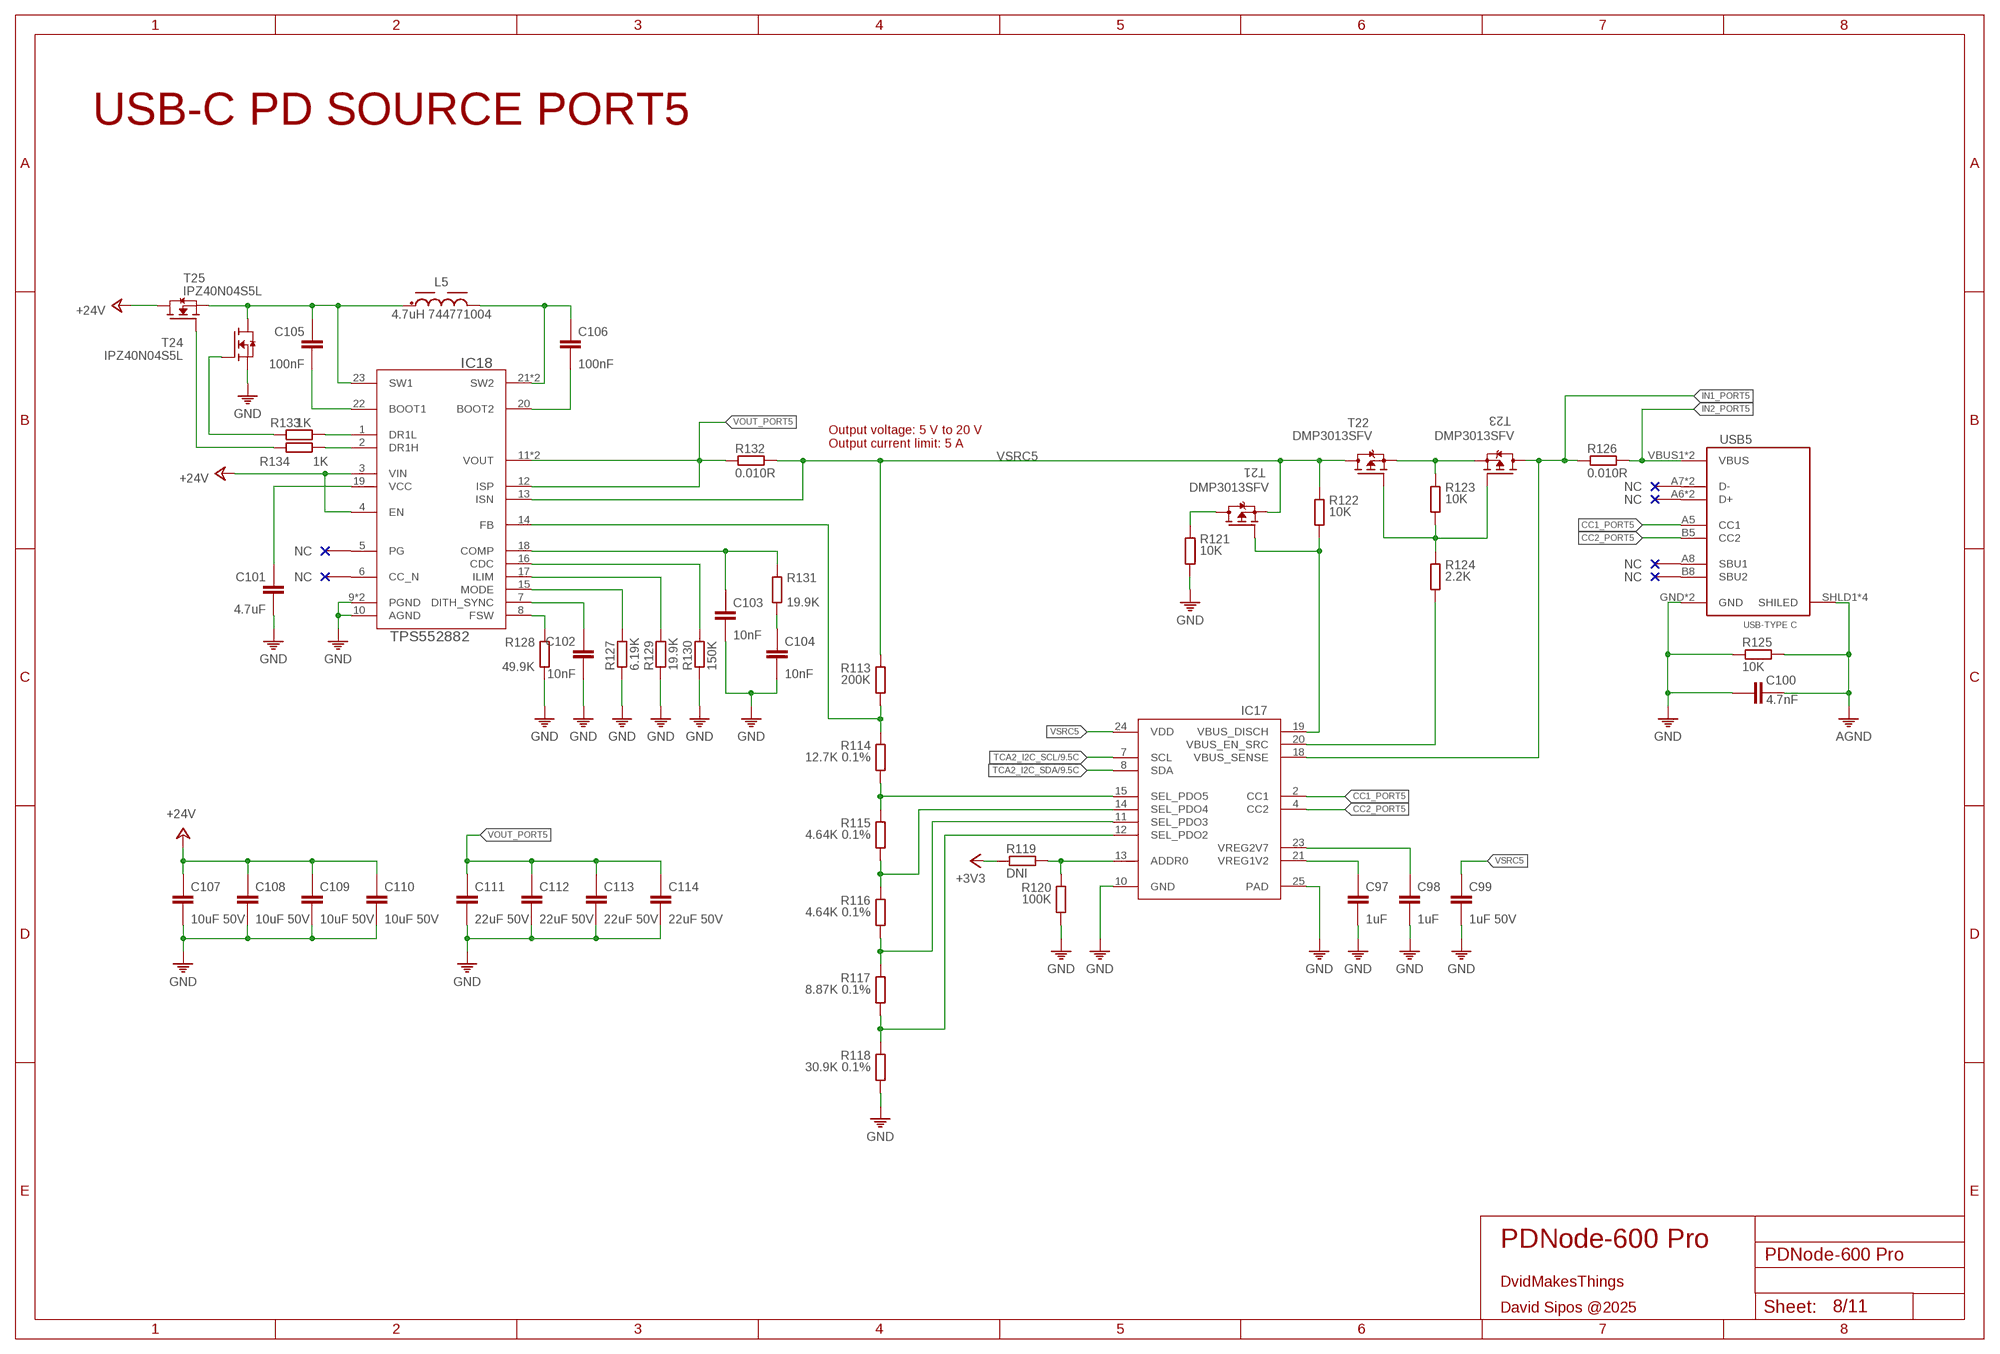
[diagram p7: schematic, sheet 8]

### Parts
C97  1uF  C-0402  [C0402]
C98  1uF  C-0402  [C0402]
C99  1uF 50V  C-0603  [C0603]
C100  4.7nF  C-0402  [C0402]
C101  4.7uF  C-0402  [C0402]
C102  10nF  C-0201  [0201]
C103  10nF  C-0201  [0201]
C104  10nF  C-0201  [0201]
C105  100nF  C-0402  [C0402]
C106  100nF  C-0402  [C0402]
C107  10uF 50V  C-0805  [C0805]
C108  10uF 50V  C-0805  [C0805]
C109  10uF 50V  C-0805  [C0805]
C110  10uF 50V  C-0805  [C0805]
C111  22uF 50V  C-0805  [C0805]
C112  22uF 50V  C-0805  [C0805]
C113  22uF 50V  C-0805  [C0805]
C114  22uF 50V  C-0805  [C0805]
IC17  STUSB4710  [QFN24]
IC18  TPS552882  [RPM0026A-MFG]
L5  4.7uH 744771004  WE-PD_1280_74477004  [WE-PD_1280]
R113  200K  R0402  [0402]
R114  12.7K 0.1%  R0402  [0402]
R115  4.64K 0.1%  R0402  [0402]
R116  4.64K 0.1%  R0402  [0402]
R117  8.87K 0.1%  R0402  [0402]
R118  30.9K 0.1%  R0402  [0402]
R119  DNI  R0201  [R0201]
R120  100K  R0201  [R0201]
R121  10K  R1206  [1206]
R122  10K  R0603  [0603]
R123  10K  R0603  [0603]
R124  2.2K  R0603  [0603]
R125  10K  R0402  [0402]
R126  0.010R  R2512  [2512]
R127  6.19K  R0201  [R0201]
R128  49.9K  R0201  [R0201]
R129  19.9K  R0201  [R0201]
R130  150K  R0201  [R0201]
R131  19.9K  R0201  [R0201]
R132  0.010R  R2512  [2512]
R133  1K  R0201  [R0201]
R134  1K  R0201  [R0201]
T21  DMP3013SFV  DMP3013SFV-7UX  [POWERDI3333-8_UX_DIO-L]
T22  DMP3013SFV  DMP3013SFV-7UX  [POWERDI3333-8_UX_DIO-L]
T23  DMP3013SFV  DMP3013SFV-7UX  [POWERDI3333-8_UX_DIO-L]
T24  IPZ40N04S5L  IPZ40N04S5L7R4ATMA1  [POWERDI3333-8_UX_DIO-L]
T25  IPZ40N04S5L  IPZ40N04S5L7R4ATMA1  [POWERDI3333-8_UX_DIO-L]
USB5  USB_C-THT  [USB-C]

### Nets
+3V3: R119.1 ; also sheet 3,4,5,6,7,9,10,11
+24V: C107.1 C108.1 C109.1 C110.1 IC18.3(VIN) IC18.4(EN) T25.5(D) T25.6(D) T25.7(D) T25.8(D) T25.9(D) ; also sheet 4,5,6,7,9,10,11
AGND: C100.2 R125.2 USB5.SHLD1(SHILED) USB5.SHLD2(SHILED) USB5.SHLD3(SHILED) USB5.SHLD4(SHILED) ; also sheet 3,4,5,6,7,9,10,11
CC1_PORT5: IC17.2(CC1) USB5.A5(CC1)
CC2_PORT5: IC17.4(CC2) USB5.B5(CC2)
GND: C97.2 C98.2 C99.2 C100.1 C101.2 C102.2 C103.2 C104.2 C107.2 C108.2 C109.2 C110.2 C111.2 C112.2 C113.2 C114.2 IC17.10(GND) IC17.25(PAD) IC18.9(PGND) IC18.10(AGND) IC18.24(PGND) R118.2 R120.2 R121.2 R125.1 R127.2 R128.2 R129.2 R130.2 T24.1(S) T24.2(S) T24.3(S) USB5.GND USB5.GND2(GND) ; also sheet 3,4,5,6,7,9,10,11
IN1_PORT5: IC17.18(VBUS_SENSE) R126.1 T23.5(D) T23.6(D) T23.7(D) T23.8(D) T23.9(D)
IN2_PORT5: R126.2 USB5.VBUS1(VBUS) USB5.VBUS2(VBUS)
N$137: IC18.14(FB) R113.2 R114.1
N$138: IC17.15(SEL_PDO5) R114.2 R115.1
N$139: IC17.14(SEL_PDO4) R115.2 R116.1
N$140: IC17.11(SEL_PDO3) R116.2 R117.1
N$141: IC17.12(SEL_PDO2) R117.2 R118.1
N$142: C97.1 IC17.21(VREG1V2)
N$143: C98.1 IC17.23(VREG2V7)
N$144: IC17.13(ADDR0) R119.2 R120.1
N$145: R121.1 T21.5(D) T21.6(D) T21.7(D) T21.8(D) T21.9(D)
N$146: IC17.19(VBUS_DISCH) R122.2 T21.4(G)
N$147: R123.1 T22.1(S) T22.2(S) T22.3(S) T23.1(S) T23.2(S) T23.3(S)
N$148: R123.2 R124.1 T22.4(G) T23.4(G)
N$149: IC17.20(VBUS_EN_SRC) R124.2
N$150: C104.1 R131.2
N$151: IC18.8(FSW) R128.1
N$152: C102.1 IC18.7(DITH_SYNC)
N$153: IC18.15(MODE) R127.1
N$154: IC18.17(ILIM) R129.1
N$155: IC18.16(CDC) R130.1
N$156: C103.1 IC18.18(COMP) R131.1
N$157: C101.1 IC18.19(VCC)
N$158: C105.1 IC18.23(SW1) L5.1 T24.5(D) T24.6(D) T24.7(D) T24.8(D) T24.9(D) T25.1(S) T25.2(S) T25.3(S)
N$159: C106.1 IC18.21(SW2) IC18.25(SW2) L5.2
N$160: C105.2 IC18.22(BOOT1)
N$161: C106.2 IC18.20(BOOT2)
N$163: R134.2 T25.4(G)
N$164: R133.2 T24.4(G)
N$165: IC18.1(DR1L) R133.1
N$166: IC18.2(DR1H) R134.1
TCA2_I2C_SCL: IC17.7(SCL) ; also sheet 9
TCA2_I2C_SDA: IC17.8(SDA) ; also sheet 9
VOUT_PORT5: C111.1 C112.1 C113.1 C114.1 IC18.11(VOUT) IC18.12(ISP) IC18.26(VOUT) R132.1
VSRC5: C99.1 IC17.24(VDD) IC18.13(ISN) R113.1 R122.1 R132.2 T21.1(S) T21.2(S) T21.3(S) T22.5(D) T22.6(D) T22.7(D) T22.8(D) T22.9(D)
Unconnected: IC18.5(PG) IC18.6(CC_N) USB5.A6(D+) USB5.A7(D-) USB5.A8(SBU1) USB5.B6(D+) USB5.B7(D-) USB5.B8(SBU2)

### Notes on the sheet
- USB-C PD SOURCE PORT5
- Output voltage: 5 V to 20 V
  Output current limit: 5 A
- PDNode-600 Pro
- DvidMakesThings
- David Sipos @2025

## Sheet 9 of 11: USB-C PD SOURCE PORT6
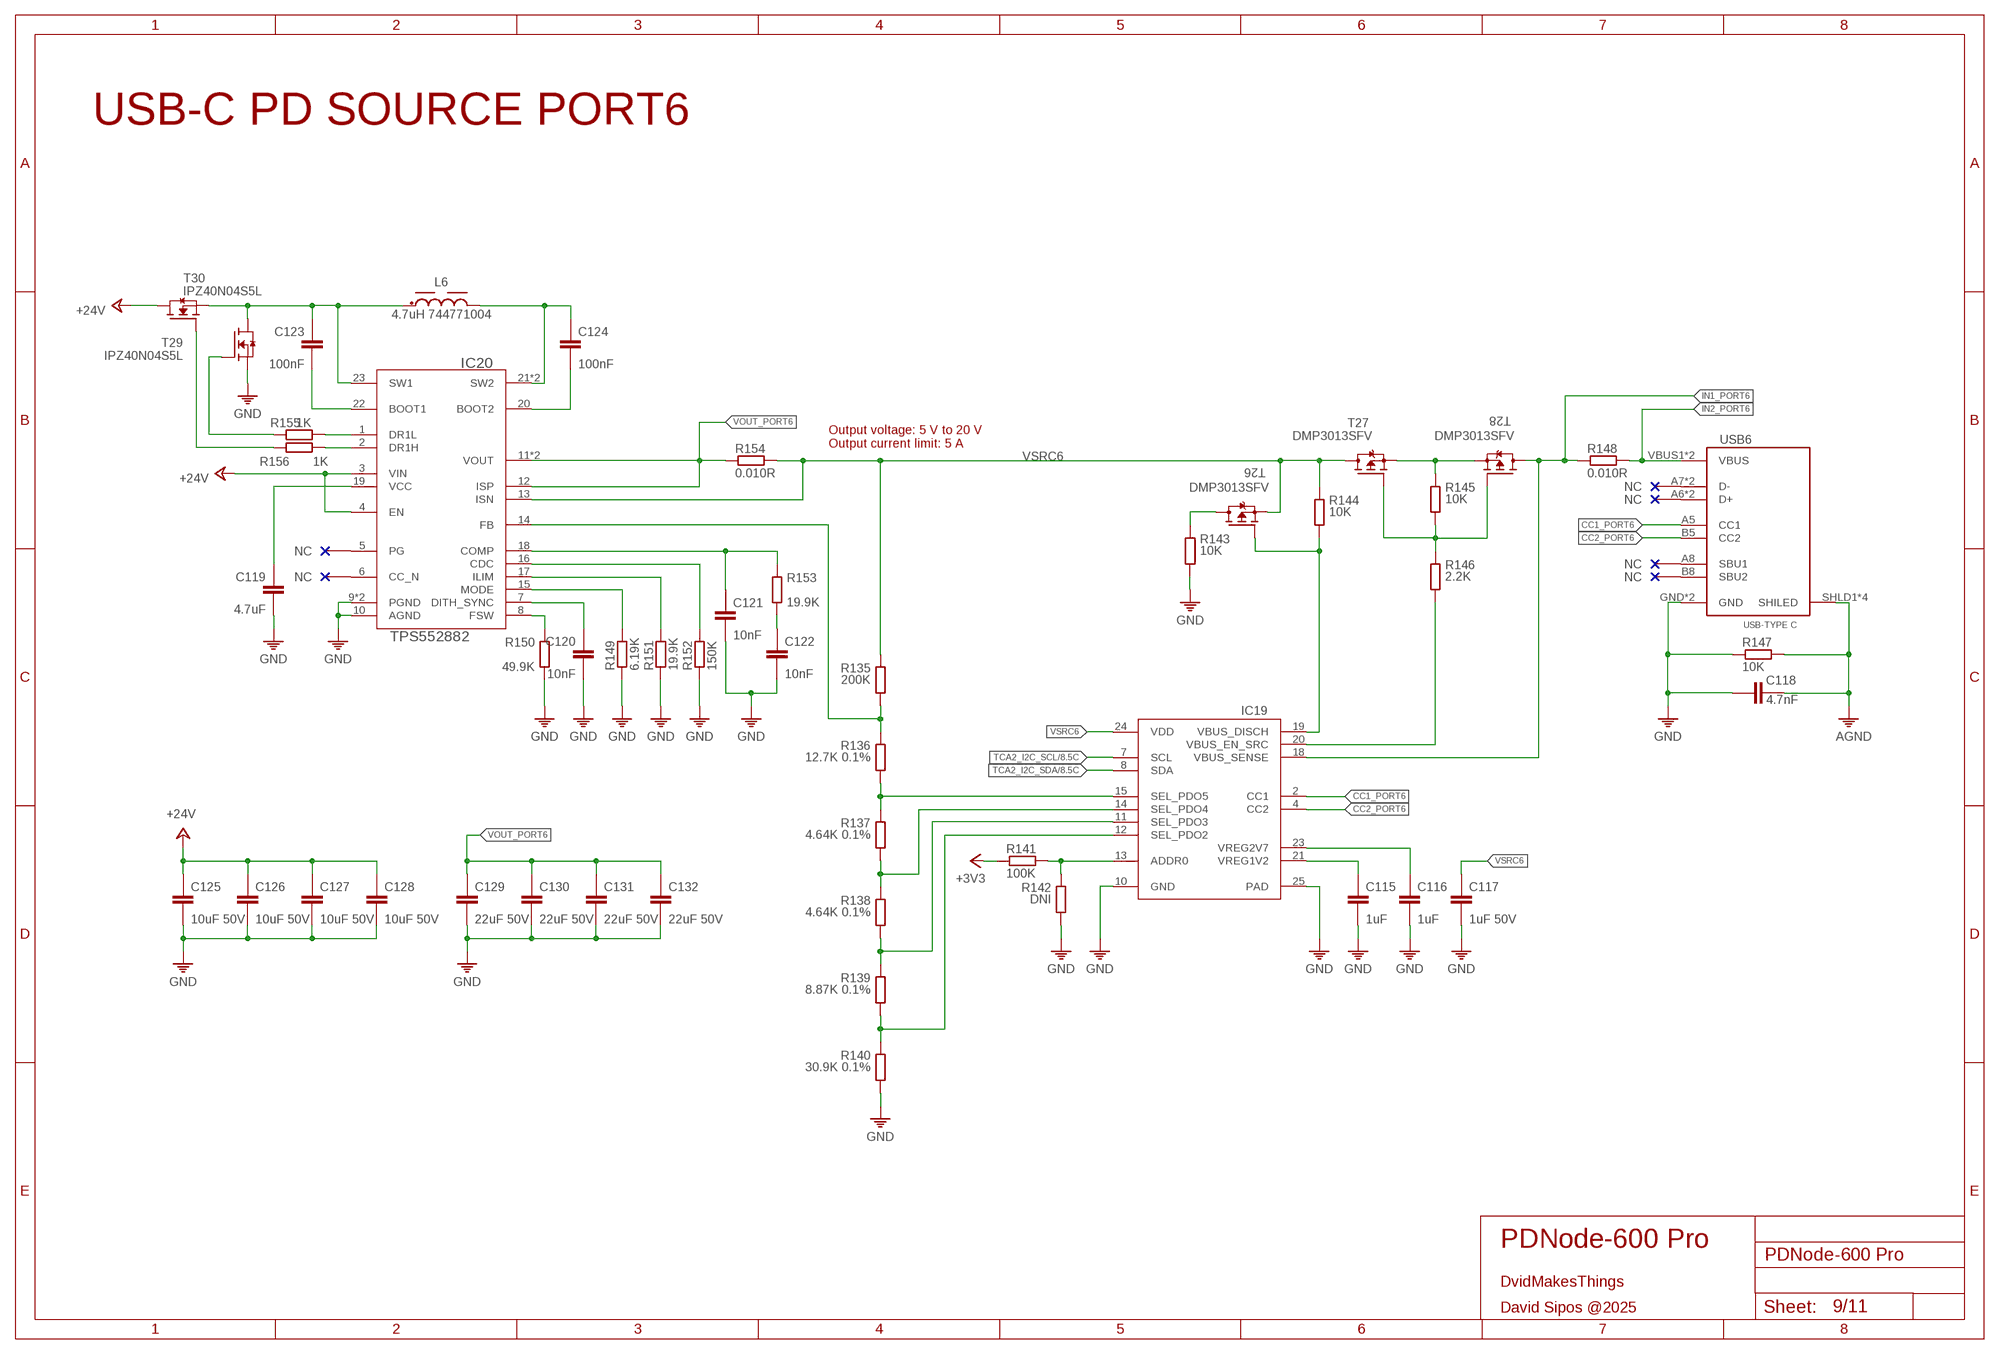
[diagram p8: schematic, sheet 9]

### Parts
C115  1uF  C-0402  [C0402]
C116  1uF  C-0402  [C0402]
C117  1uF 50V  C-0603  [C0603]
C118  4.7nF  C-0402  [C0402]
C119  4.7uF  C-0402  [C0402]
C120  10nF  C-0201  [0201]
C121  10nF  C-0201  [0201]
C122  10nF  C-0201  [0201]
C123  100nF  C-0402  [C0402]
C124  100nF  C-0402  [C0402]
C125  10uF 50V  C-0805  [C0805]
C126  10uF 50V  C-0805  [C0805]
C127  10uF 50V  C-0805  [C0805]
C128  10uF 50V  C-0805  [C0805]
C129  22uF 50V  C-0805  [C0805]
C130  22uF 50V  C-0805  [C0805]
C131  22uF 50V  C-0805  [C0805]
C132  22uF 50V  C-0805  [C0805]
IC19  STUSB4710  [QFN24]
IC20  TPS552882  [RPM0026A-MFG]
L6  4.7uH 744771004  WE-PD_1280_74477004  [WE-PD_1280]
R135  200K  R0402  [0402]
R136  12.7K 0.1%  R0402  [0402]
R137  4.64K 0.1%  R0402  [0402]
R138  4.64K 0.1%  R0402  [0402]
R139  8.87K 0.1%  R0402  [0402]
R140  30.9K 0.1%  R0402  [0402]
R141  100K  R0201  [R0201]
R142  DNI  R0201  [R0201]
R143  10K  R1206  [1206]
R144  10K  R0603  [0603]
R145  10K  R0603  [0603]
R146  2.2K  R0603  [0603]
R147  10K  R0402  [0402]
R148  0.010R  R2512  [2512]
R149  6.19K  R0201  [R0201]
R150  49.9K  R0201  [R0201]
R151  19.9K  R0201  [R0201]
R152  150K  R0201  [R0201]
R153  19.9K  R0201  [R0201]
R154  0.010R  R2512  [2512]
R155  1K  R0201  [R0201]
R156  1K  R0201  [R0201]
T26  DMP3013SFV  DMP3013SFV-7UX  [POWERDI3333-8_UX_DIO-L]
T27  DMP3013SFV  DMP3013SFV-7UX  [POWERDI3333-8_UX_DIO-L]
T28  DMP3013SFV  DMP3013SFV-7UX  [POWERDI3333-8_UX_DIO-L]
T29  IPZ40N04S5L  IPZ40N04S5L7R4ATMA1  [POWERDI3333-8_UX_DIO-L]
T30  IPZ40N04S5L  IPZ40N04S5L7R4ATMA1  [POWERDI3333-8_UX_DIO-L]
USB6  USB_C-THT  [USB-C]

### Nets
+3V3: R141.1 ; also sheet 3,4,5,6,7,8,10,11
+24V: C125.1 C126.1 C127.1 C128.1 IC20.3(VIN) IC20.4(EN) T30.5(D) T30.6(D) T30.7(D) T30.8(D) T30.9(D) ; also sheet 4,5,6,7,8,10,11
AGND: C118.2 R147.2 USB6.SHLD1(SHILED) USB6.SHLD2(SHILED) USB6.SHLD3(SHILED) USB6.SHLD4(SHILED) ; also sheet 3,4,5,6,7,8,10,11
CC1_PORT6: IC19.2(CC1) USB6.A5(CC1)
CC2_PORT6: IC19.4(CC2) USB6.B5(CC2)
GND: C115.2 C116.2 C117.2 C118.1 C119.2 C120.2 C121.2 C122.2 C125.2 C126.2 C127.2 C128.2 C129.2 C130.2 C131.2 C132.2 IC19.10(GND) IC19.25(PAD) IC20.9(PGND) IC20.10(AGND) IC20.24(PGND) R140.2 R142.2 R143.2 R147.1 R149.2 R150.2 R151.2 R152.2 T29.1(S) T29.2(S) T29.3(S) USB6.GND USB6.GND2(GND) ; also sheet 3,4,5,6,7,8,10,11
IN1_PORT6: IC19.18(VBUS_SENSE) R148.1 T28.5(D) T28.6(D) T28.7(D) T28.8(D) T28.9(D)
IN2_PORT6: R148.2 USB6.VBUS1(VBUS) USB6.VBUS2(VBUS)
N$167: IC20.14(FB) R135.2 R136.1
N$168: IC19.15(SEL_PDO5) R136.2 R137.1
N$169: IC19.14(SEL_PDO4) R137.2 R138.1
N$170: IC19.11(SEL_PDO3) R138.2 R139.1
N$171: IC19.12(SEL_PDO2) R139.2 R140.1
N$172: C115.1 IC19.21(VREG1V2)
N$173: C116.1 IC19.23(VREG2V7)
N$174: IC19.13(ADDR0) R141.2 R142.1
N$175: R143.1 T26.5(D) T26.6(D) T26.7(D) T26.8(D) T26.9(D)
N$176: IC19.19(VBUS_DISCH) R144.2 T26.4(G)
N$177: R145.1 T27.1(S) T27.2(S) T27.3(S) T28.1(S) T28.2(S) T28.3(S)
N$178: R145.2 R146.1 T27.4(G) T28.4(G)
N$179: IC19.20(VBUS_EN_SRC) R146.2
N$180: C122.1 R153.2
N$181: IC20.8(FSW) R150.1
N$182: C120.1 IC20.7(DITH_SYNC)
N$183: IC20.15(MODE) R149.1
N$184: IC20.17(ILIM) R151.1
N$185: IC20.16(CDC) R152.1
N$186: C121.1 IC20.18(COMP) R153.1
N$187: C119.1 IC20.19(VCC)
N$188: C123.1 IC20.23(SW1) L6.1 T29.5(D) T29.6(D) T29.7(D) T29.8(D) T29.9(D) T30.1(S) T30.2(S) T30.3(S)
N$189: C124.1 IC20.21(SW2) IC20.25(SW2) L6.2
N$190: C123.2 IC20.22(BOOT1)
N$191: C124.2 IC20.20(BOOT2)
N$193: R156.2 T30.4(G)
N$194: R155.2 T29.4(G)
N$195: IC20.1(DR1L) R155.1
N$196: IC20.2(DR1H) R156.1
TCA2_I2C_SCL: IC19.7(SCL) ; also sheet 8
TCA2_I2C_SDA: IC19.8(SDA) ; also sheet 8
VOUT_PORT6: C129.1 C130.1 C131.1 C132.1 IC20.11(VOUT) IC20.12(ISP) IC20.26(VOUT) R154.1
VSRC6: C117.1 IC19.24(VDD) IC20.13(ISN) R135.1 R144.1 R154.2 T26.1(S) T26.2(S) T26.3(S) T27.5(D) T27.6(D) T27.7(D) T27.8(D) T27.9(D)
Unconnected: IC20.5(PG) IC20.6(CC_N) USB6.A6(D+) USB6.A7(D-) USB6.A8(SBU1) USB6.B6(D+) USB6.B7(D-) USB6.B8(SBU2)

### Notes on the sheet
- USB-C PD SOURCE PORT6
- Output voltage: 5 V to 20 V
  Output current limit: 5 A
- PDNode-600 Pro
- DvidMakesThings
- David Sipos @2025

## Sheet 10 of 11: USB-C PD SOURCE PORT7
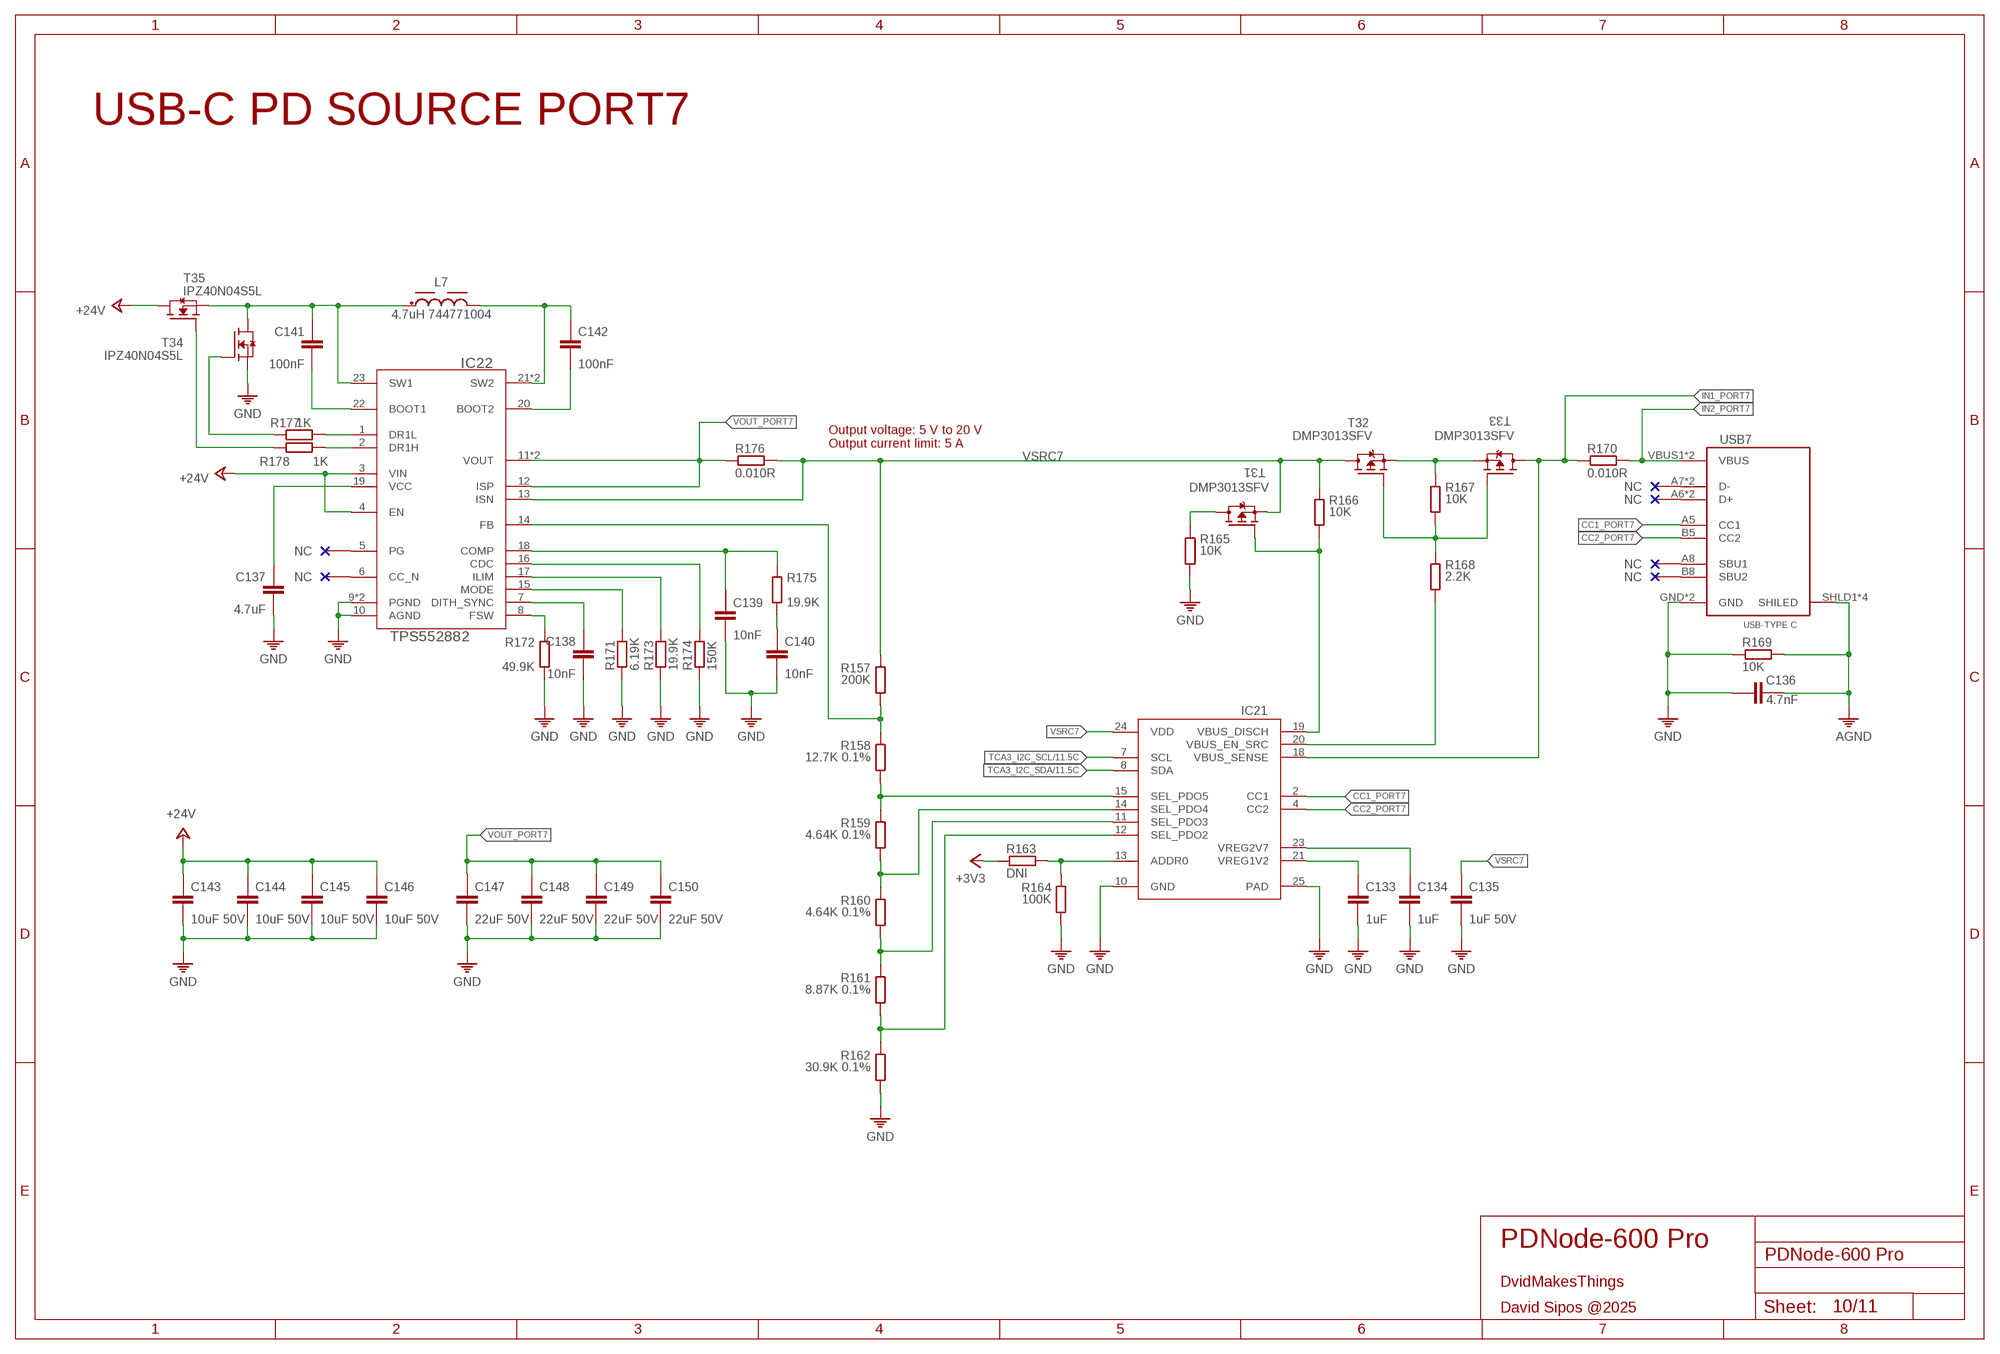
[diagram p9: schematic, sheet 10]

### Parts
C133  1uF  C-0402  [C0402]
C134  1uF  C-0402  [C0402]
C135  1uF 50V  C-0603  [C0603]
C136  4.7nF  C-0402  [C0402]
C137  4.7uF  C-0402  [C0402]
C138  10nF  C-0201  [0201]
C139  10nF  C-0201  [0201]
C140  10nF  C-0201  [0201]
C141  100nF  C-0402  [C0402]
C142  100nF  C-0402  [C0402]
C143  10uF 50V  C-0805  [C0805]
C144  10uF 50V  C-0805  [C0805]
C145  10uF 50V  C-0805  [C0805]
C146  10uF 50V  C-0805  [C0805]
C147  22uF 50V  C-0805  [C0805]
C148  22uF 50V  C-0805  [C0805]
C149  22uF 50V  C-0805  [C0805]
C150  22uF 50V  C-0805  [C0805]
IC21  STUSB4710  [QFN24]
IC22  TPS552882  [RPM0026A-MFG]
L7  4.7uH 744771004  WE-PD_1280_74477004  [WE-PD_1280]
R157  200K  R0402  [0402]
R158  12.7K 0.1%  R0402  [0402]
R159  4.64K 0.1%  R0402  [0402]
R160  4.64K 0.1%  R0402  [0402]
R161  8.87K 0.1%  R0402  [0402]
R162  30.9K 0.1%  R0402  [0402]
R163  DNI  R0201  [R0201]
R164  100K  R0201  [R0201]
R165  10K  R1206  [1206]
R166  10K  R0603  [0603]
R167  10K  R0603  [0603]
R168  2.2K  R0603  [0603]
R169  10K  R0402  [0402]
R170  0.010R  R2512  [2512]
R171  6.19K  R0201  [R0201]
R172  49.9K  R0201  [R0201]
R173  19.9K  R0201  [R0201]
R174  150K  R0201  [R0201]
R175  19.9K  R0201  [R0201]
R176  0.010R  R2512  [2512]
R177  1K  R0201  [R0201]
R178  1K  R0201  [R0201]
T31  DMP3013SFV  DMP3013SFV-7UX  [POWERDI3333-8_UX_DIO-L]
T32  DMP3013SFV  DMP3013SFV-7UX  [POWERDI3333-8_UX_DIO-L]
T33  DMP3013SFV  DMP3013SFV-7UX  [POWERDI3333-8_UX_DIO-L]
T34  IPZ40N04S5L  IPZ40N04S5L7R4ATMA1  [POWERDI3333-8_UX_DIO-L]
T35  IPZ40N04S5L  IPZ40N04S5L7R4ATMA1  [POWERDI3333-8_UX_DIO-L]
USB7  USB_C-THT  [USB-C]

### Nets
+3V3: R163.1 ; also sheet 3,4,5,6,7,8,9,11
+24V: C143.1 C144.1 C145.1 C146.1 IC22.3(VIN) IC22.4(EN) T35.5(D) T35.6(D) T35.7(D) T35.8(D) T35.9(D) ; also sheet 4,5,6,7,8,9,11
AGND: C136.2 R169.2 USB7.SHLD1(SHILED) USB7.SHLD2(SHILED) USB7.SHLD3(SHILED) USB7.SHLD4(SHILED) ; also sheet 3,4,5,6,7,8,9,11
CC1_PORT7: IC21.2(CC1) USB7.A5(CC1)
CC2_PORT7: IC21.4(CC2) USB7.B5(CC2)
GND: C133.2 C134.2 C135.2 C136.1 C137.2 C138.2 C139.2 C140.2 C143.2 C144.2 C145.2 C146.2 C147.2 C148.2 C149.2 C150.2 IC21.10(GND) IC21.25(PAD) IC22.9(PGND) IC22.10(AGND) IC22.24(PGND) R162.2 R164.2 R165.2 R169.1 R171.2 R172.2 R173.2 R174.2 T34.1(S) T34.2(S) T34.3(S) USB7.GND USB7.GND2(GND) ; also sheet 3,4,5,6,7,8,9,11
IN1_PORT7: IC21.18(VBUS_SENSE) R170.1 T33.5(D) T33.6(D) T33.7(D) T33.8(D) T33.9(D)
IN2_PORT7: R170.2 USB7.VBUS1(VBUS) USB7.VBUS2(VBUS)
N$197: IC22.14(FB) R157.2 R158.1
N$198: IC21.15(SEL_PDO5) R158.2 R159.1
N$199: IC21.14(SEL_PDO4) R159.2 R160.1
N$200: IC21.11(SEL_PDO3) R160.2 R161.1
N$201: IC21.12(SEL_PDO2) R161.2 R162.1
N$202: C133.1 IC21.21(VREG1V2)
N$203: C134.1 IC21.23(VREG2V7)
N$204: IC21.13(ADDR0) R163.2 R164.1
N$205: R165.1 T31.5(D) T31.6(D) T31.7(D) T31.8(D) T31.9(D)
N$206: IC21.19(VBUS_DISCH) R166.2 T31.4(G)
N$207: R167.1 T32.1(S) T32.2(S) T32.3(S) T33.1(S) T33.2(S) T33.3(S)
N$208: R167.2 R168.1 T32.4(G) T33.4(G)
N$209: IC21.20(VBUS_EN_SRC) R168.2
N$210: C140.1 R175.2
N$211: IC22.8(FSW) R172.1
N$212: C138.1 IC22.7(DITH_SYNC)
N$213: IC22.15(MODE) R171.1
N$214: IC22.17(ILIM) R173.1
N$215: IC22.16(CDC) R174.1
N$216: C139.1 IC22.18(COMP) R175.1
N$217: C137.1 IC22.19(VCC)
N$218: C141.1 IC22.23(SW1) L7.1 T34.5(D) T34.6(D) T34.7(D) T34.8(D) T34.9(D) T35.1(S) T35.2(S) T35.3(S)
N$219: C142.1 IC22.21(SW2) IC22.25(SW2) L7.2
N$220: C141.2 IC22.22(BOOT1)
N$221: C142.2 IC22.20(BOOT2)
N$223: R178.2 T35.4(G)
N$224: R177.2 T34.4(G)
N$225: IC22.1(DR1L) R177.1
N$226: IC22.2(DR1H) R178.1
TCA3_I2C_SCL: IC21.7(SCL) ; also sheet 11
TCA3_I2C_SDA: IC21.8(SDA) ; also sheet 11
VOUT_PORT7: C147.1 C148.1 C149.1 C150.1 IC22.11(VOUT) IC22.12(ISP) IC22.26(VOUT) R176.1
VSRC7: C135.1 IC21.24(VDD) IC22.13(ISN) R157.1 R166.1 R176.2 T31.1(S) T31.2(S) T31.3(S) T32.5(D) T32.6(D) T32.7(D) T32.8(D) T32.9(D)
Unconnected: IC22.5(PG) IC22.6(CC_N) USB7.A6(D+) USB7.A7(D-) USB7.A8(SBU1) USB7.B6(D+) USB7.B7(D-) USB7.B8(SBU2)

### Notes on the sheet
- USB-C PD SOURCE PORT7
- Output voltage: 5 V to 20 V
  Output current limit: 5 A
- PDNode-600 Pro
- DvidMakesThings
- David Sipos @2025

## Sheet 11 of 11: USB-C PD SOURCE PORT8
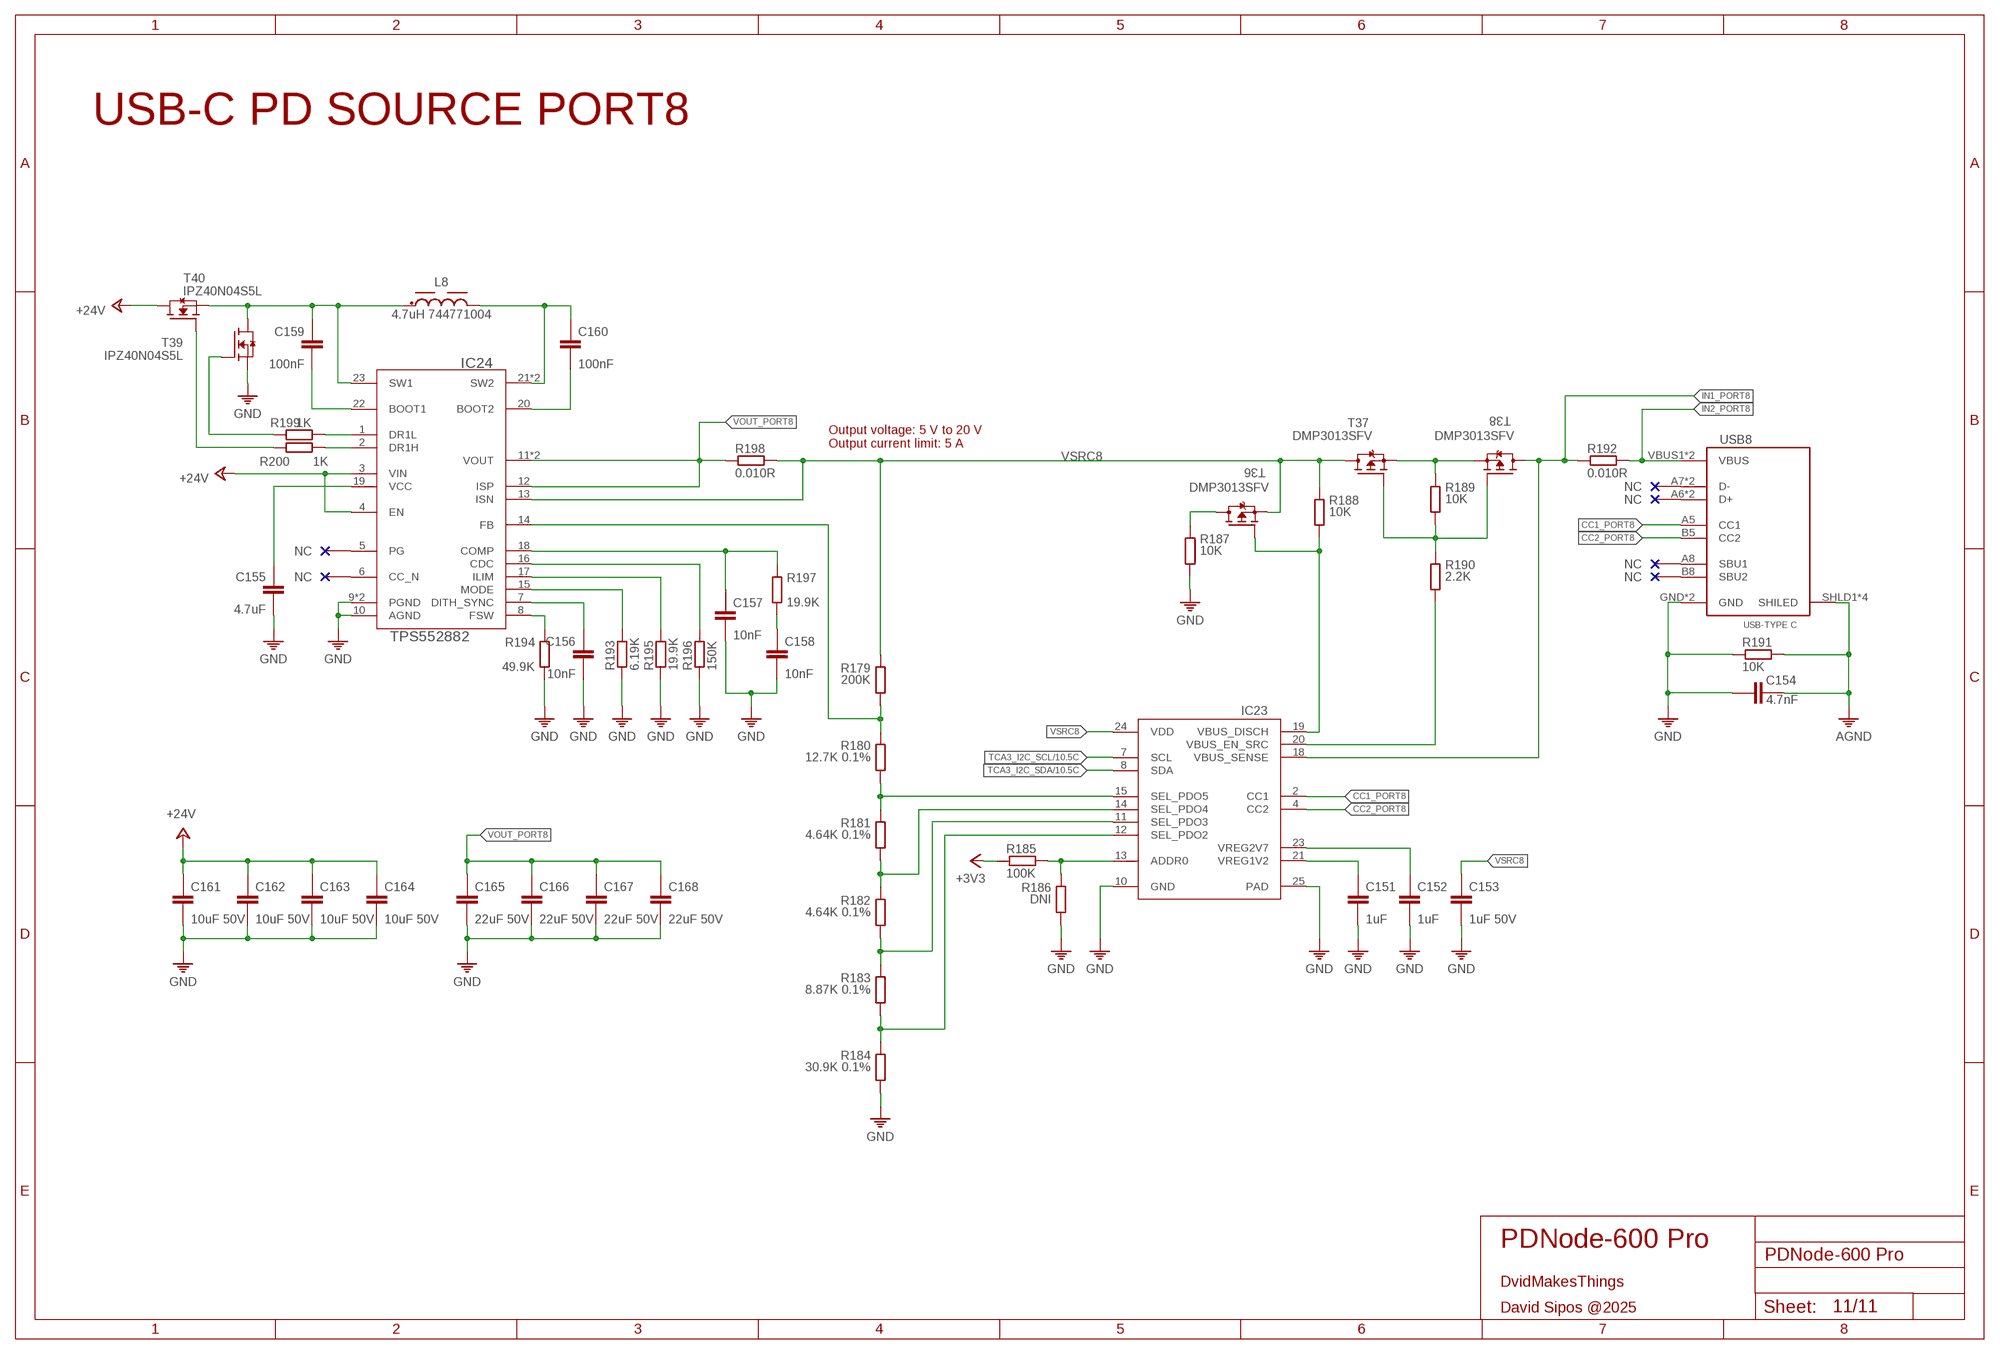
[diagram p10: schematic, sheet 11]

### Parts
C151  1uF  C-0402  [C0402]
C152  1uF  C-0402  [C0402]
C153  1uF 50V  C-0603  [C0603]
C154  4.7nF  C-0402  [C0402]
C155  4.7uF  C-0402  [C0402]
C156  10nF  C-0201  [0201]
C157  10nF  C-0201  [0201]
C158  10nF  C-0201  [0201]
C159  100nF  C-0402  [C0402]
C160  100nF  C-0402  [C0402]
C161  10uF 50V  C-0805  [C0805]
C162  10uF 50V  C-0805  [C0805]
C163  10uF 50V  C-0805  [C0805]
C164  10uF 50V  C-0805  [C0805]
C165  22uF 50V  C-0805  [C0805]
C166  22uF 50V  C-0805  [C0805]
C167  22uF 50V  C-0805  [C0805]
C168  22uF 50V  C-0805  [C0805]
IC23  STUSB4710  [QFN24]
IC24  TPS552882  [RPM0026A-MFG]
L8  4.7uH 744771004  WE-PD_1280_74477004  [WE-PD_1280]
R179  200K  R0402  [0402]
R180  12.7K 0.1%  R0402  [0402]
R181  4.64K 0.1%  R0402  [0402]
R182  4.64K 0.1%  R0402  [0402]
R183  8.87K 0.1%  R0402  [0402]
R184  30.9K 0.1%  R0402  [0402]
R185  100K  R0201  [R0201]
R186  DNI  R0201  [R0201]
R187  10K  R1206  [1206]
R188  10K  R0603  [0603]
R189  10K  R0603  [0603]
R190  2.2K  R0603  [0603]
R191  10K  R0402  [0402]
R192  0.010R  R2512  [2512]
R193  6.19K  R0201  [R0201]
R194  49.9K  R0201  [R0201]
R195  19.9K  R0201  [R0201]
R196  150K  R0201  [R0201]
R197  19.9K  R0201  [R0201]
R198  0.010R  R2512  [2512]
R199  1K  R0201  [R0201]
R200  1K  R0201  [R0201]
T36  DMP3013SFV  DMP3013SFV-7UX  [POWERDI3333-8_UX_DIO-L]
T37  DMP3013SFV  DMP3013SFV-7UX  [POWERDI3333-8_UX_DIO-L]
T38  DMP3013SFV  DMP3013SFV-7UX  [POWERDI3333-8_UX_DIO-L]
T39  IPZ40N04S5L  IPZ40N04S5L7R4ATMA1  [POWERDI3333-8_UX_DIO-L]
T40  IPZ40N04S5L  IPZ40N04S5L7R4ATMA1  [POWERDI3333-8_UX_DIO-L]
USB8  USB_C-THT  [USB-C]

### Nets
+3V3: R185.1 ; also sheet 3,4,5,6,7,8,9,10
+24V: C161.1 C162.1 C163.1 C164.1 IC24.3(VIN) IC24.4(EN) T40.5(D) T40.6(D) T40.7(D) T40.8(D) T40.9(D) ; also sheet 4,5,6,7,8,9,10
AGND: C154.2 R191.2 USB8.SHLD1(SHILED) USB8.SHLD2(SHILED) USB8.SHLD3(SHILED) USB8.SHLD4(SHILED) ; also sheet 3,4,5,6,7,8,9,10
CC1_PORT8: IC23.2(CC1) USB8.A5(CC1)
CC2_PORT8: IC23.4(CC2) USB8.B5(CC2)
GND: C151.2 C152.2 C153.2 C154.1 C155.2 C156.2 C157.2 C158.2 C161.2 C162.2 C163.2 C164.2 C165.2 C166.2 C167.2 C168.2 IC23.10(GND) IC23.25(PAD) IC24.9(PGND) IC24.10(AGND) IC24.24(PGND) R184.2 R186.2 R187.2 R191.1 R193.2 R194.2 R195.2 R196.2 T39.1(S) T39.2(S) T39.3(S) USB8.GND USB8.GND2(GND) ; also sheet 3,4,5,6,7,8,9,10
IN1_PORT8: IC23.18(VBUS_SENSE) R192.1 T38.5(D) T38.6(D) T38.7(D) T38.8(D) T38.9(D)
IN2_PORT8: R192.2 USB8.VBUS1(VBUS) USB8.VBUS2(VBUS)
N$227: IC24.14(FB) R179.2 R180.1
N$228: IC23.15(SEL_PDO5) R180.2 R181.1
N$229: IC23.14(SEL_PDO4) R181.2 R182.1
N$230: IC23.11(SEL_PDO3) R182.2 R183.1
N$231: IC23.12(SEL_PDO2) R183.2 R184.1
N$232: C151.1 IC23.21(VREG1V2)
N$233: C152.1 IC23.23(VREG2V7)
N$234: IC23.13(ADDR0) R185.2 R186.1
N$235: R187.1 T36.5(D) T36.6(D) T36.7(D) T36.8(D) T36.9(D)
N$236: IC23.19(VBUS_DISCH) R188.2 T36.4(G)
N$237: R189.1 T37.1(S) T37.2(S) T37.3(S) T38.1(S) T38.2(S) T38.3(S)
N$238: R189.2 R190.1 T37.4(G) T38.4(G)
N$239: IC23.20(VBUS_EN_SRC) R190.2
N$240: C158.1 R197.2
N$241: IC24.8(FSW) R194.1
N$242: C156.1 IC24.7(DITH_SYNC)
N$243: IC24.15(MODE) R193.1
N$244: IC24.17(ILIM) R195.1
N$245: IC24.16(CDC) R196.1
N$246: C157.1 IC24.18(COMP) R197.1
N$247: C155.1 IC24.19(VCC)
N$248: C159.1 IC24.23(SW1) L8.1 T39.5(D) T39.6(D) T39.7(D) T39.8(D) T39.9(D) T40.1(S) T40.2(S) T40.3(S)
N$249: C160.1 IC24.21(SW2) IC24.25(SW2) L8.2
N$250: C159.2 IC24.22(BOOT1)
N$251: C160.2 IC24.20(BOOT2)
N$253: R200.2 T40.4(G)
N$254: R199.2 T39.4(G)
N$255: IC24.1(DR1L) R199.1
N$256: IC24.2(DR1H) R200.1
TCA3_I2C_SCL: IC23.7(SCL) ; also sheet 10
TCA3_I2C_SDA: IC23.8(SDA) ; also sheet 10
VOUT_PORT8: C165.1 C166.1 C167.1 C168.1 IC24.11(VOUT) IC24.12(ISP) IC24.26(VOUT) R198.1
VSRC8: C153.1 IC23.24(VDD) IC24.13(ISN) R179.1 R188.1 R198.2 T36.1(S) T36.2(S) T36.3(S) T37.5(D) T37.6(D) T37.7(D) T37.8(D) T37.9(D)
Unconnected: IC24.5(PG) IC24.6(CC_N) USB8.A6(D+) USB8.A7(D-) USB8.A8(SBU1) USB8.B6(D+) USB8.B7(D-) USB8.B8(SBU2)

### Notes on the sheet
- USB-C PD SOURCE PORT8
- Output voltage: 5 V to 20 V
  Output current limit: 5 A
- PDNode-600 Pro
- DvidMakesThings
- David Sipos @2025

## Library data of the parts
C1-C4 C6-C9 C11-C14 C16-C84 C86-C168 = ds_passive:C
C5 C10 C15 C85 = ds_passive:CPOL
D1 D3 D5 D7 = LED:CHIP-FLAT-G: Green LED - Generic; CATEGORY: LED; COLOR: Green; DESCRIPTION: Green LED Indication 0603 (1608 Metric); PACKAGE_SIZE: 0603; PACKAGE_TYPE: SMD; SUBCATEGORY: Chip LED; TYPE: Square with Flat Top
D2 D4 D6 D8 = LED:CHIP-FLAT-R: Red LED - Generic; CATEGORY: LED; COLOR: Red; DESCRIPTION: Red LED Indication 0603 (1608 Metric); PACKAGE_SIZE: 0603; PACKAGE_TYPE: SMD; SUBCATEGORY: Chip LED; TYPE: Square with Flat Top
IC1-IC3 IC8 = ds_ic_peripherals:AP22653W6: PRECISION ADJUSTABLE CURRENT-LIMITED POWER SWITCHES; DATASHEET: https://www.diodes.com/assets/Datasheets/AP22652_53_52A_53A.pdf
IC4-IC7 = ds_ic_logic:74LVC1G04: Single inverter
IC9 IC11 IC13 IC15 IC17 IC19 IC21 IC23 = ds_ic_peripherals:STUSB4710: Stand-alone USB PD controller (with short-to-VBUS protection); DATASHEET: https://www.st.com/content/ccc/resource/technical/document/datasheet/group3/2f/24/4e/67/ed/d6/4b/af/DM00383615/files/DM00383615.pdf/jcr:content/translations/en.DM00383615.pdf
IC10 IC12 IC14 IC16 IC18 IC20 IC22 IC24 = ds_ic_vreg:TPS552882; COPYRIGHT: Copyright (C) 2025 Ultra Librarian. All rights reserved.; DATASHEET: https://www.ti.com/lit/ds/symlink/tps552882-q1.pdf?ts=1746222078398&ref_url=https%253A%252F%252Fwww.ti.com%252Fproduct%252FTPS552882-Q1; MANUFACTURER_PART_NUMBER: TPS552882QRPMRQ1; MFR_NAME: Texas Instruments; REFDES: RefDes; TYPE: TYPE
J1-J4 = Wurth_Connectors_WR-USB:629104151021: WR-COM USB 2.0 Type A Horizontal SMT with pegs Kind Properties Durability:1500 Mating cycles Quality Class:1500 Mating cycles Connector Type:USB Gender:Receptacle Type:Horizontal General Information Operating Temperature:-40 up to +85 °C Compliance:RoHS Electrical Properties IR 1:1.5A Working Voltage:30V (AC) Withstanding Voltage:750 V (AC) Contact Resistance:30 mΩ Material Properties Insulator Material:PA6T Insulator Flammability Rating:UL94 V-0 Color:Black Cover Material:Brass Cover Plating:Nickel Contact Material:Copper Alloy Contact Plating:Selective Gold Contact Type:Stamped Shielding Material:Brass Shielding Plating:Nickel <https://www.we-online.com/catalog/media/o33052v209%20Family_WR-COM_USB_Type%20A_Horiztonal_629104151021.jpg> Details see: www.we-online.com/components/products/COM_2_0_SMT_TYPE_A_HORIZONTAL <https://www.we-online.com/en/components/products/COM_2_0_SMT_TYPE_A_HORIZONTAL> Updated by Ella Wu 2023-01-30 2021 (C) Würth Elektronik; APPLICATION: USB 2.0; DATASHEET-URL: https://www.we-online.com/redexpert/spec/629104151021?ae; GERDER: Receptacle; INTERFACE-TYPE: Type A; IR: 1.5A; MOUNT: SMT; PACKAGING: Tape and Reel; PART-NUMBER: 629104151021; PINS: 4; TYPE: Horizontal; WORKING-VOLTAGE: 30V(AC)
L1-L8 = Wurth_Power Magnetics_WE-PD:WE-PD_1280: WE-PD SMT Power Inductor Characteristics AECQ 200 Qualified Ultra low RDC and RAC Highest possible saturation current based on Ferrite Suitable for switching frequency up to 10MHz Temperature dependent parameter available on Redexpert Operating Temperature from -40°C to +125°C / +150°C Types WE-PD: Since always with low loss material, tight tolerances and high saturation behavior compared to other manufacturers in the market WE-PD Robust: Plastic base improves the mechanical stability and efficiency WE-PD Performance: MnZn core improves Saturation and RDC for highest efficiency Applications Switch Mode Power supplies from 0,1W up to 300W Integrated DC DC Converter Ideal for Switch Mode Power supplies with extreme high efficiency (>95%) <https://www.we-online.com/components/media/o194227v209%20Family_WE-PD.jpg> Details see: www.we-online.com/en/components/products/WE-PD Updated by Ella Wu 2023-02-17 2023 (C) Wurth Elektronik; DATASHEET-URL: https://www.we-online.com/redexpert/spec/74477004?ae; FRES: 31.2MHz; IR: 9.5A; ISAT: 11A; MOUNT: SMT; PART-NUMBER: 74477004; RDC-MAX: 12mohm; RDC-TYP: 9mohm; SIZE: 1280; VALUE: 4.7uH; VERSION: Standard
R1-R200 = ds_passive:R
T1-T3 T6-T8 T11-T13 T16-T18 T21-T23 T26-T28 T31-T33 T36-T38 = ds_active:DMP3013SFV-7; DATASHEET: https://www.diodes.com/assets/Datasheets/DMP3013SFV.pdf; MANUFACTURER_PART_NUMBER: DMP3013SFV-7; MFR_NAME: Diodes Inc
T4 T5 T9 T10 T14 T15 T19 T20 T24 T25 T29 T30 T34 T35 T39 T40 = ds_active:IPZ40N04S5L7R4ATMA1; COPYRIGHT: Copyright (C) 2025 Ultra Librarian. All rights reserved.; DATASHEET: https://www.infineon.com/dgdl/Infineon-IPZ40N04S5L-7R4-DS-v01_00-EN.pdf?fileId=5546d4624cb7f111014d6601321448a0; MANUFACTURER_PART_NUMBER: IPZ40N04S5L7R4ATMA1; MFR_NAME: Infineon
USB1-USB8 = ds_con:USB_C
VUSBA1-VUSBA4 = testpad:TP: Test pad

## Net classes
0 default: width 0.18 mm, drill 0.15 mm, clearance 0.191 mm